# Altium project MB1297 revC.PrjPcb (part 1 of 2)
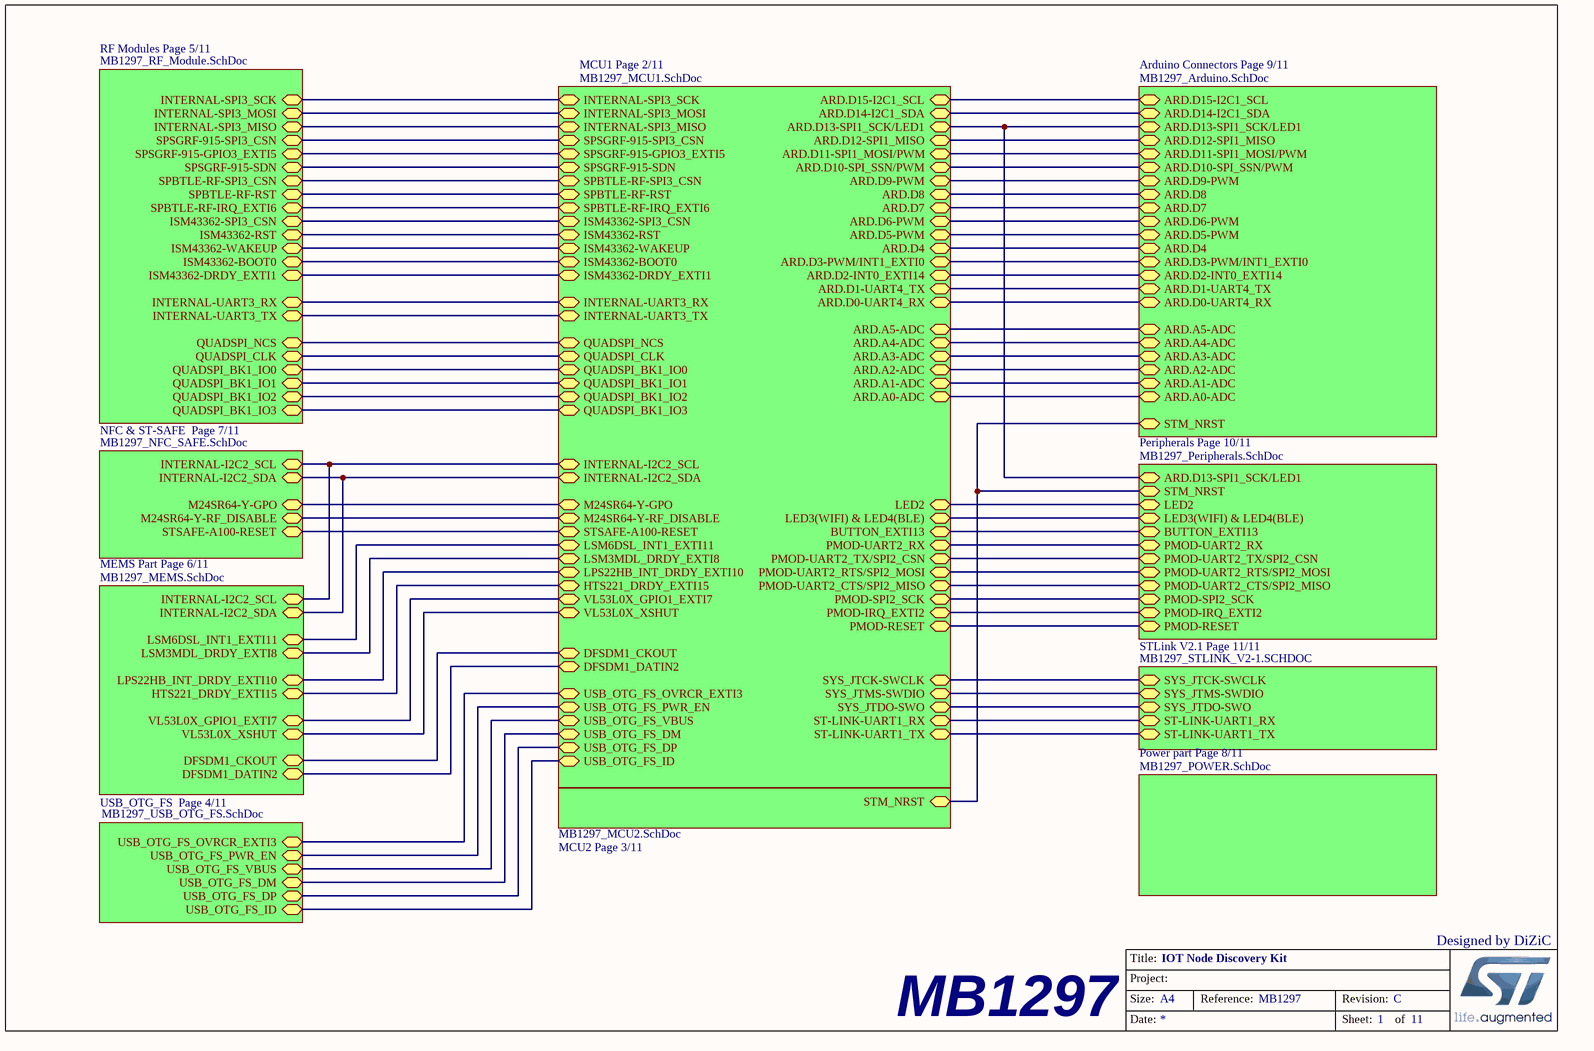
[diagram p0: MB1297_Intro.SchDoc]
11 sheets, 231 parts. Net scope: hierarchical (ports join the sheet entries above them; power ports are global).
Board file: MB1297 revC1.PcbDoc
Sheets:
  MB1297_Intro.SchDoc
    MCU1 Page 2/11 = MB1297_MCU1.SchDoc
    MCU2 Page 3/11 = MB1297_MCU2.SchDoc
    RF Modules Page 5/11 = MB1297_RF_Module.SchDoc
    Peripherals Page 10/11 = MB1297_Peripherals.SchDoc
    NFC & ST-SAFE  Page 7/11 = MB1297_NFC_SAFE.SchDoc
    STLink V2.1 Page 11/11 = MB1297_STLINK_V2-1.SCHDOC
    Arduino Connectors Page 9/11 = MB1297_Arduino.SchDoc
    MEMS Part Page 6/11 = MB1297_MEMS.SchDoc
    USB_OTG_FS  Page 4/11 = MB1297_USB_OTG_FS.SchDoc
    Power part Page 8/11 = MB1297_POWER.SchDoc

## Sheet MB1297_Intro.SchDoc: IOT Node Discovery Kit
size A4; DocumentNumber: MB1297; Revision: C; SheetNumber: 1; SheetTotal: 11

### Sub-sheets
Arduino Connectors Page 9/11 = MB1297_Arduino.SchDoc: ARD.D3-PWM/INT1_EXTI0, ARD.D2-INT0_EXTI14, ARD.D1-UART4_TX, ARD.D0-UART4_RX, ARD.A5-ADC, ARD.A4-ADC, ARD.A3-ADC, ARD.A2-ADC, ARD.A1-ADC, ARD.A0-ADC, ARD.D4, ARD.D5-PWM, ARD.D6-PWM, ARD.D7, ARD.D8, ARD.D9-PWM, ARD.D10-SPI_SSN/PWM, ARD.D11-SPI1_MOSI/PWM, ARD.D12-SPI1_MISO, ARD.D13-SPI1_SCK/LED1, ARD.D14-I2C1_SDA, ARD.D15-I2C1_SCL, STM_NRST
MCU1 Page 2/11 = MB1297_MCU1.SchDoc: INTERNAL-SPI3_SCK, INTERNAL-SPI3_MOSI, INTERNAL-SPI3_MISO, ISM43362-SPI3_CSN, SPSGRF-915-SDN, SPSGRF-915-SPI3_CSN, SPBTLE-RF-SPI3_CSN, SYS_JTCK-SWCLK, SYS_JTMS-SWDIO, ARD.D3-PWM/INT1_EXTI0, ARD.D2-INT0_EXTI14, ARD.D1-UART4_TX, ARD.D0-UART4_RX, ARD.D4, ARD.D5-PWM, ARD.D6-PWM, ARD.D7, ARD.D8, ARD.D9-PWM, ARD.D10-SPI_SSN/PWM, ARD.D11-SPI1_MOSI/PWM, ARD.D12-SPI1_MISO, ARD.D13-SPI1_SCK/LED1, ARD.D14-I2C1_SDA, ARD.D15-I2C1_SCL, ARD.A5-ADC, ARD.A4-ADC, ARD.A3-ADC, ARD.A2-ADC, ARD.A1-ADC, ARD.A0-ADC, USB_OTG_FS_OVRCR_EXTI3, USB_OTG_FS_PWR_EN, USB_OTG_FS_VBUS, USB_OTG_FS_DM, USB_OTG_FS_DP, USB_OTG_FS_ID, INTERNAL-I2C2_SCL, INTERNAL-I2C2_SDA, M24SR64-Y-GPO, M24SR64-Y-RF_DISABLE, STSAFE-A100-RESET, LED2, LED3(WIFI) & LED4(BLE), BUTTON_EXTI13, PMOD-UART2_RTS/SPI2_MOSI, PMOD-UART2_CTS/SPI2_MISO, PMOD-SPI2_SCK, PMOD-IRQ_EXTI2, PMOD-RESET, PMOD-UART2_RX, PMOD-UART2_TX/SPI2_CSN, LSM6DSL_INT1_EXTI11, LSM3MDL_DRDY_EXTI8, LPS22HB_INT_DRDY_EXTI10, HTS221_DRDY_EXTI15, VL53L0X_GPIO1_EXTI7, VL53L0X_XSHUT, DFSDM1_CKOUT, DFSDM1_DATIN2, SPBTLE-RF-RST, SYS_JTDO-SWO, QUADSPI_NCS, QUADSPI_CLK, QUADSPI_BK1_IO0, QUADSPI_BK1_IO1, QUADSPI_BK1_IO2, QUADSPI_BK1_IO3, SPSGRF-915-GPIO3_EXTI5, SPBTLE-RF-IRQ_EXTI6, ISM43362-DRDY_EXTI1, ISM43362-RST, ISM43362-WAKEUP, ISM43362-BOOT0, INTERNAL-UART3_RX, INTERNAL-UART3_TX, ST-LINK-UART1_RX, ST-LINK-UART1_TX
MCU2 Page 3/11 = MB1297_MCU2.SchDoc: STM_NRST
MEMS Part Page 6/11 = MB1297_MEMS.SchDoc: INTERNAL-I2C2_SCL, INTERNAL-I2C2_SDA, LSM6DSL_INT1_EXTI11, LSM3MDL_DRDY_EXTI8, LPS22HB_INT_DRDY_EXTI10, HTS221_DRDY_EXTI15, VL53L0X_GPIO1_EXTI7, VL53L0X_XSHUT, DFSDM1_CKOUT, DFSDM1_DATIN2
NFC & ST-SAFE  Page 7/11 = MB1297_NFC_SAFE.SchDoc: INTERNAL-I2C2_SCL, INTERNAL-I2C2_SDA, M24SR64-Y-GPO, M24SR64-Y-RF_DISABLE, STSAFE-A100-RESET
Peripherals Page 10/11 = MB1297_Peripherals.SchDoc: STM_NRST, ARD.D13-SPI1_SCK/LED1, LED2, LED3(WIFI) & LED4(BLE), BUTTON_EXTI13, PMOD-UART2_RTS/SPI2_MOSI, PMOD-UART2_CTS/SPI2_MISO, PMOD-SPI2_SCK, PMOD-IRQ_EXTI2, PMOD-RESET, PMOD-UART2_RX, PMOD-UART2_TX/SPI2_CSN
Power part Page 8/11 = MB1297_POWER.SchDoc: no entries
RF Modules Page 5/11 = MB1297_RF_Module.SchDoc: INTERNAL-SPI3_SCK, INTERNAL-SPI3_MOSI, INTERNAL-SPI3_MISO, SPSGRF-915-SPI3_CSN, SPSGRF-915-GPIO3_EXTI5, SPSGRF-915-SDN, SPBTLE-RF-SPI3_CSN, SPBTLE-RF-RST, SPBTLE-RF-IRQ_EXTI6, QUADSPI_NCS, QUADSPI_CLK, QUADSPI_BK1_IO0, QUADSPI_BK1_IO1, QUADSPI_BK1_IO2, QUADSPI_BK1_IO3, INTERNAL-UART3_RX, INTERNAL-UART3_TX, ISM43362-SPI3_CSN, ISM43362-RST, ISM43362-WAKEUP, ISM43362-BOOT0, ISM43362-DRDY_EXTI1
STLink V2.1 Page 11/11 = MB1297_STLINK_V2-1.SCHDOC: SYS_JTCK-SWCLK, SYS_JTMS-SWDIO, SYS_JTDO-SWO, ST-LINK-UART1_RX, ST-LINK-UART1_TX
USB_OTG_FS  Page 4/11 = MB1297_USB_OTG_FS.SchDoc: USB_OTG_FS_OVRCR_EXTI3, USB_OTG_FS_PWR_EN, USB_OTG_FS_VBUS, USB_OTG_FS_DM, USB_OTG_FS_DP, USB_OTG_FS_ID

### Nets
USB_N: sheet MCU1 Page 2/11/USB_OTG_FS_DM, sheet USB_OTG_FS  Page 4/11/USB_OTG_FS_DM
USB_P: sheet MCU1 Page 2/11/USB_OTG_FS_DP, sheet USB_OTG_FS  Page 4/11/USB_OTG_FS_DP
NetC3_2: sheet MCU2 Page 3/11/STM_NRST, sheet Peripherals Page 10/11/STM_NRST, sheet Arduino Connectors Page 9/11/STM_NRST
NetC66_1: sheet MCU1 Page 2/11/USB_OTG_FS_VBUS, sheet USB_OTG_FS  Page 4/11/USB_OTG_FS_VBUS
NetCN1_1: sheet MCU1 Page 2/11/ARD.D8, sheet Arduino Connectors Page 9/11/ARD.D8
NetCN1_2: sheet MCU1 Page 2/11/ARD.D9-PWM, sheet Arduino Connectors Page 9/11/ARD.D9-PWM
NetCN1_3: sheet MCU1 Page 2/11/ARD.D10-SPI_SSN/PWM, sheet Arduino Connectors Page 9/11/ARD.D10-SPI_SSN/PWM
NetCN1_4: sheet MCU1 Page 2/11/ARD.D11-SPI1_MOSI/PWM, sheet Arduino Connectors Page 9/11/ARD.D11-SPI1_MOSI/PWM
NetCN1_5: sheet MCU1 Page 2/11/ARD.D12-SPI1_MISO, sheet Arduino Connectors Page 9/11/ARD.D12-SPI1_MISO
NetCN1_6: sheet MCU1 Page 2/11/ARD.D13-SPI1_SCK/LED1, sheet Peripherals Page 10/11/ARD.D13-SPI1_SCK/LED1, sheet Arduino Connectors Page 9/11/ARD.D13-SPI1_SCK/LED1
NetCN1_9: sheet MCU1 Page 2/11/ARD.D14-I2C1_SDA, sheet Arduino Connectors Page 9/11/ARD.D14-I2C1_SDA
NetCN1_10: sheet MCU1 Page 2/11/ARD.D15-I2C1_SCL, sheet Arduino Connectors Page 9/11/ARD.D15-I2C1_SCL
NetCN3_1: sheet MCU1 Page 2/11/ARD.D0-UART4_RX, sheet Arduino Connectors Page 9/11/ARD.D0-UART4_RX
NetCN3_2: sheet MCU1 Page 2/11/ARD.D1-UART4_TX, sheet Arduino Connectors Page 9/11/ARD.D1-UART4_TX
NetCN3_3: sheet MCU1 Page 2/11/ARD.D2-INT0_EXTI14, sheet Arduino Connectors Page 9/11/ARD.D2-INT0_EXTI14
NetCN3_4: sheet MCU1 Page 2/11/ARD.D3-PWM/INT1_EXTI0, sheet Arduino Connectors Page 9/11/ARD.D3-PWM/INT1_EXTI0
NetCN3_5: sheet MCU1 Page 2/11/ARD.D4, sheet Arduino Connectors Page 9/11/ARD.D4
NetCN3_6: sheet MCU1 Page 2/11/ARD.D5-PWM, sheet Arduino Connectors Page 9/11/ARD.D5-PWM
NetCN3_7: sheet MCU1 Page 2/11/ARD.D6-PWM, sheet Arduino Connectors Page 9/11/ARD.D6-PWM
NetCN3_8: sheet MCU1 Page 2/11/ARD.D7, sheet Arduino Connectors Page 9/11/ARD.D7
NetCN4_1: sheet MCU1 Page 2/11/ARD.A0-ADC, sheet Arduino Connectors Page 9/11/ARD.A0-ADC
NetCN4_2: sheet MCU1 Page 2/11/ARD.A1-ADC, sheet Arduino Connectors Page 9/11/ARD.A1-ADC
NetCN4_3: sheet MCU1 Page 2/11/ARD.A2-ADC, sheet Arduino Connectors Page 9/11/ARD.A2-ADC
NetCN4_4: sheet MCU1 Page 2/11/ARD.A3-ADC, sheet Arduino Connectors Page 9/11/ARD.A3-ADC
NetCN4_5: sheet MCU1 Page 2/11/ARD.A4-ADC, sheet Arduino Connectors Page 9/11/ARD.A4-ADC
NetCN4_6: sheet MCU1 Page 2/11/ARD.A5-ADC, sheet Arduino Connectors Page 9/11/ARD.A5-ADC
NetCN9_4: sheet MCU1 Page 2/11/USB_OTG_FS_ID, sheet USB_OTG_FS  Page 4/11/USB_OTG_FS_ID
NetCN10_7: sheet MCU1 Page 2/11/PMOD-IRQ_EXTI2, sheet Peripherals Page 10/11/PMOD-IRQ_EXTI2
NetCN10_8: sheet MCU1 Page 2/11/PMOD-RESET, sheet Peripherals Page 10/11/PMOD-RESET
NetM1_4: sheet MCU1 Page 2/11/SPBTLE-RF-IRQ_EXTI6, sheet RF Modules Page 5/11/SPBTLE-RF-IRQ_EXTI6
NetM1_7: sheet MCU1 Page 2/11/INTERNAL-SPI3_SCK, sheet RF Modules Page 5/11/INTERNAL-SPI3_SCK
NetM1_8: sheet MCU1 Page 2/11/INTERNAL-SPI3_MISO, sheet RF Modules Page 5/11/INTERNAL-SPI3_MISO
NetM1_9: sheet MCU1 Page 2/11/INTERNAL-SPI3_MOSI, sheet RF Modules Page 5/11/INTERNAL-SPI3_MOSI
NetM1_10: sheet MCU1 Page 2/11/SPBTLE-RF-SPI3_CSN, sheet RF Modules Page 5/11/SPBTLE-RF-SPI3_CSN
NetM1_11: sheet MCU1 Page 2/11/SPBTLE-RF-RST, sheet RF Modules Page 5/11/SPBTLE-RF-RST
NetM2_12: sheet MCU1 Page 2/11/ISM43362-SPI3_CSN, sheet RF Modules Page 5/11/ISM43362-SPI3_CSN
NetM2_13: sheet MCU1 Page 2/11/ISM43362-DRDY_EXTI1, sheet RF Modules Page 5/11/ISM43362-DRDY_EXTI1
NetM2_16: sheet MCU1 Page 2/11/ISM43362-WAKEUP, sheet RF Modules Page 5/11/ISM43362-WAKEUP
NetM2_21: sheet MCU1 Page 2/11/INTERNAL-UART3_TX, sheet RF Modules Page 5/11/INTERNAL-UART3_TX
NetM2_22: sheet MCU1 Page 2/11/INTERNAL-UART3_RX, sheet RF Modules Page 5/11/INTERNAL-UART3_RX
NetM2_33: sheet MCU1 Page 2/11/ISM43362-BOOT0, sheet RF Modules Page 5/11/ISM43362-BOOT0
NetM2_34: sheet MCU1 Page 2/11/ISM43362-RST, sheet RF Modules Page 5/11/ISM43362-RST
NetM3_1: sheet MCU1 Page 2/11/SPSGRF-915-GPIO3_EXTI5, sheet RF Modules Page 5/11/SPSGRF-915-GPIO3_EXTI5
NetM3_10: sheet MCU1 Page 2/11/SPSGRF-915-SPI3_CSN, sheet RF Modules Page 5/11/SPSGRF-915-SPI3_CSN
NetM3_11: sheet MCU1 Page 2/11/SPSGRF-915-SDN, sheet RF Modules Page 5/11/SPSGRF-915-SDN
NetR1_2: sheet MCU1 Page 2/11/M24SR64-Y-RF_DISABLE, sheet NFC & ST-SAFE  Page 7/11/M24SR64-Y-RF_DISABLE
NetR4_2: sheet MCU1 Page 2/11/M24SR64-Y-GPO, sheet NFC & ST-SAFE  Page 7/11/M24SR64-Y-GPO
NetR6_2: sheet MCU1 Page 2/11/DFSDM1_CKOUT, sheet MEMS Part Page 6/11/DFSDM1_CKOUT
NetR10_2: sheet MCU1 Page 2/11/INTERNAL-I2C2_SCL, sheet NFC & ST-SAFE  Page 7/11/INTERNAL-I2C2_SCL, sheet MEMS Part Page 6/11/INTERNAL-I2C2_SCL
NetR11_2: sheet MCU1 Page 2/11/INTERNAL-I2C2_SDA, sheet NFC & ST-SAFE  Page 7/11/INTERNAL-I2C2_SDA, sheet MEMS Part Page 6/11/INTERNAL-I2C2_SDA
NetR13_2: sheet MCU1 Page 2/11/DFSDM1_DATIN2, sheet MEMS Part Page 6/11/DFSDM1_DATIN2
NetR14_2: sheet MCU1 Page 2/11/VL53L0X_GPIO1_EXTI7, sheet MEMS Part Page 6/11/VL53L0X_GPIO1_EXTI7
NetR15_2: sheet MCU1 Page 2/11/VL53L0X_XSHUT, sheet MEMS Part Page 6/11/VL53L0X_XSHUT
NetR20_1: sheet MCU1 Page 2/11/LED2, sheet Peripherals Page 10/11/LED2
NetR21_1: sheet MCU1 Page 2/11/LED3(WIFI) & LED4(BLE), sheet Peripherals Page 10/11/LED3(WIFI) & LED4(BLE)
NetR32_2: sheet MCU1 Page 2/11/SYS_JTCK-SWCLK, sheet STLink V2.1 Page 11/11/SYS_JTCK-SWCLK
NetR33_2: sheet MCU1 Page 2/11/SYS_JTMS-SWDIO, sheet STLink V2.1 Page 11/11/SYS_JTMS-SWDIO
NetR35_2: sheet MCU1 Page 2/11/SYS_JTDO-SWO, sheet STLink V2.1 Page 11/11/SYS_JTDO-SWO
NetR42_2: sheet MCU1 Page 2/11/ST-LINK-UART1_RX, sheet STLink V2.1 Page 11/11/ST-LINK-UART1_RX
NetR43_2: sheet MCU1 Page 2/11/ST-LINK-UART1_TX, sheet STLink V2.1 Page 11/11/ST-LINK-UART1_TX
NetR56_1: sheet MCU1 Page 2/11/USB_OTG_FS_OVRCR_EXTI3, sheet USB_OTG_FS  Page 4/11/USB_OTG_FS_OVRCR_EXTI3
NetR62_2: sheet MCU1 Page 2/11/USB_OTG_FS_PWR_EN, sheet USB_OTG_FS  Page 4/11/USB_OTG_FS_PWR_EN
NetSB3_1: sheet MCU1 Page 2/11/BUTTON_EXTI13, sheet Peripherals Page 10/11/BUTTON_EXTI13
NetSB12_2: sheet MCU1 Page 2/11/PMOD-UART2_TX/SPI2_CSN, sheet Peripherals Page 10/11/PMOD-UART2_TX/SPI2_CSN
NetSB15_2: sheet MCU1 Page 2/11/PMOD-UART2_RTS/SPI2_MOSI, sheet Peripherals Page 10/11/PMOD-UART2_RTS/SPI2_MOSI
NetSB18_2: sheet MCU1 Page 2/11/PMOD-UART2_CTS/SPI2_MISO, sheet Peripherals Page 10/11/PMOD-UART2_CTS/SPI2_MISO
NetSB20_1: sheet MCU1 Page 2/11/PMOD-UART2_RX, sheet Peripherals Page 10/11/PMOD-UART2_RX
NetSB21_1: sheet MCU1 Page 2/11/PMOD-SPI2_SCK, sheet Peripherals Page 10/11/PMOD-SPI2_SCK
NetU1_41: sheet MCU1 Page 2/11/QUADSPI_CLK, sheet RF Modules Page 5/11/QUADSPI_CLK
NetU1_42: sheet MCU1 Page 2/11/QUADSPI_NCS, sheet RF Modules Page 5/11/QUADSPI_NCS
NetU1_43: sheet MCU1 Page 2/11/QUADSPI_BK1_IO0, sheet RF Modules Page 5/11/QUADSPI_BK1_IO0
NetU1_44: sheet MCU1 Page 2/11/QUADSPI_BK1_IO1, sheet RF Modules Page 5/11/QUADSPI_BK1_IO1
NetU1_45: sheet MCU1 Page 2/11/QUADSPI_BK1_IO2, sheet RF Modules Page 5/11/QUADSPI_BK1_IO2
NetU1_46: sheet MCU1 Page 2/11/QUADSPI_BK1_IO3, sheet RF Modules Page 5/11/QUADSPI_BK1_IO3
NetU1_57: sheet MCU1 Page 2/11/LPS22HB_INT_DRDY_EXTI10, sheet MEMS Part Page 6/11/LPS22HB_INT_DRDY_EXTI10
NetU1_58: sheet MCU1 Page 2/11/LSM6DSL_INT1_EXTI11, sheet MEMS Part Page 6/11/LSM6DSL_INT1_EXTI11
NetU1_62: sheet MCU1 Page 2/11/HTS221_DRDY_EXTI15, sheet MEMS Part Page 6/11/HTS221_DRDY_EXTI15
NetU1_65: sheet MCU1 Page 2/11/LSM3MDL_DRDY_EXTI8, sheet MEMS Part Page 6/11/LSM3MDL_DRDY_EXTI8
NetU1_88: sheet MCU1 Page 2/11/STSAFE-A100-RESET, sheet NFC & ST-SAFE  Page 7/11/STSAFE-A100-RESET

### Notes on the sheet
- Designed by DiZiC
- MB1297
- Title:
- Project:
- Size:
- Date:
- A4
- Reference:
- Sheet:
- Revision:
- of

## Sheet MB1297_MCU1.SchDoc: STM32L475 - 1/2
size A4; DocumentNumber: MB1297; Revision: C; SheetNumber: 2; SheetTotal: 11
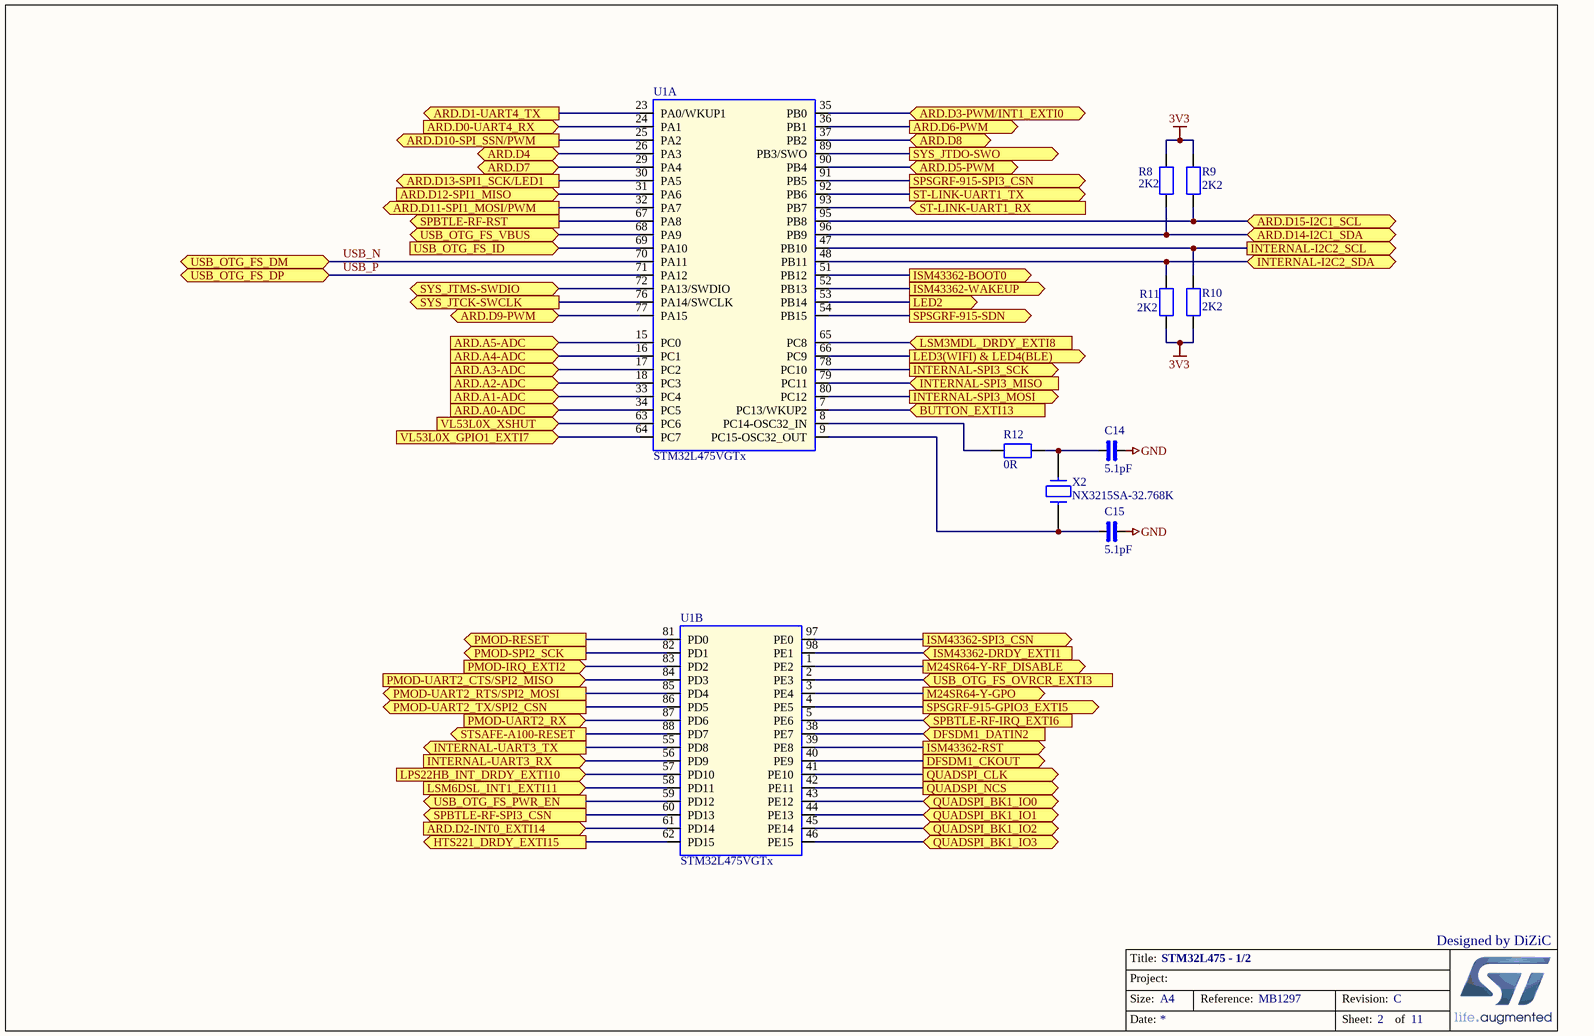
[diagram p1: MB1297_MCU1.SchDoc]

### Parts
C14  5.1pF  [0402_CAP_NPOL]
C15  5.1pF  [0402_CAP_NPOL]
R8  2K2  [0402_RES]
R9  2K2  [0402_RES]
R10  2K2  [0402_RES]
R11  2K2  [0402_RES]
R12  0R  [0402_RES]
U1  STM32L475VGTx  [LQFP100 14x14x1.6]  (parts A,B of 3)
X2  NX3215SA-32.768K  [CRY_NX3215SA_2P]

### Ports
ARD.A0-ADC, ARD.A1-ADC, ARD.A2-ADC, ARD.A3-ADC, ARD.A4-ADC, ARD.A5-ADC, ARD.D0-UART4_RX, ARD.D1-UART4_TX, ARD.D2-INT0_EXTI14, ARD.D3-PWM/INT1_EXTI0, ARD.D4, ARD.D5-PWM, ARD.D6-PWM, ARD.D7, ARD.D8, ARD.D9-PWM, ARD.D10-SPI_SSN/PWM, ARD.D11-SPI1_MOSI/PWM, ARD.D12-SPI1_MISO, ARD.D13-SPI1_SCK/LED1, ARD.D14-I2C1_SDA, ARD.D15-I2C1_SCL, BUTTON_EXTI13, DFSDM1_CKOUT, DFSDM1_DATIN2, HTS221_DRDY_EXTI15, INTERNAL-I2C2_SCL, INTERNAL-I2C2_SDA, INTERNAL-SPI3_MISO, INTERNAL-SPI3_MOSI, INTERNAL-SPI3_SCK, INTERNAL-UART3_RX, INTERNAL-UART3_TX, ISM43362-BOOT0, ISM43362-DRDY_EXTI1, ISM43362-RST, ISM43362-SPI3_CSN, ISM43362-WAKEUP, LED2, LED3(WIFI) & LED4(BLE), LPS22HB_INT_DRDY_EXTI10, LSM3MDL_DRDY_EXTI8, LSM6DSL_INT1_EXTI11, M24SR64-Y-GPO, M24SR64-Y-RF_DISABLE, PMOD-IRQ_EXTI2, PMOD-RESET, PMOD-SPI2_SCK, PMOD-UART2_CTS/SPI2_MISO, PMOD-UART2_RTS/SPI2_MOSI, PMOD-UART2_RX, PMOD-UART2_TX/SPI2_CSN, QUADSPI_BK1_IO0, QUADSPI_BK1_IO1, QUADSPI_BK1_IO2, QUADSPI_BK1_IO3, QUADSPI_CLK, QUADSPI_NCS, SPBTLE-RF-IRQ_EXTI6, SPBTLE-RF-RST, SPBTLE-RF-SPI3_CSN, SPSGRF-915-GPIO3_EXTI5, SPSGRF-915-SDN, SPSGRF-915-SPI3_CSN, ST-LINK-UART1_RX, ST-LINK-UART1_TX, STSAFE-A100-RESET, SYS_JTCK-SWCLK, SYS_JTDO-SWO, SYS_JTMS-SWDIO, USB_OTG_FS_DM, USB_OTG_FS_DP, USB_OTG_FS_ID, USB_OTG_FS_OVRCR_EXTI3, USB_OTG_FS_PWR_EN, USB_OTG_FS_VBUS, VL53L0X_GPIO1_EXTI7, VL53L0X_XSHUT

### Nets
3V3: R8.1 R9.1 R10.1 R11.1
GND: C14.2 C15.2
USB_N: U1.70(PA11) ; port USB_OTG_FS_DM
USB_P: U1.71(PA12) ; port USB_OTG_FS_DP
NetC14_1: C14.1 R12.2 X2.1
NetC15_1: C15.1 U1.9(PC15-OSC32_OUT) X2.2
NetC66_1: U1.68(PA9) ; port USB_OTG_FS_VBUS
NetCN1_1: U1.37(PB2) ; port ARD.D8
NetCN1_2: U1.77(PA15) ; port ARD.D9-PWM
NetCN1_3: U1.25(PA2) ; port ARD.D10-SPI_SSN/PWM
NetCN1_4: U1.32(PA7) ; port ARD.D11-SPI1_MOSI/PWM
NetCN1_5: U1.31(PA6) ; port ARD.D12-SPI1_MISO
NetCN1_6: U1.30(PA5) ; port ARD.D13-SPI1_SCK/LED1
NetCN1_9: R8.2 U1.96(PB9) ; port ARD.D14-I2C1_SDA
NetCN1_10: R9.2 U1.95(PB8) ; port ARD.D15-I2C1_SCL
NetCN3_1: U1.24(PA1) ; port ARD.D0-UART4_RX
NetCN3_2: U1.23(PA0/WKUP1) ; port ARD.D1-UART4_TX
NetCN3_3: U1.61(PD14) ; port ARD.D2-INT0_EXTI14
NetCN3_4: U1.35(PB0) ; port ARD.D3-PWM/INT1_EXTI0
NetCN3_5: U1.26(PA3) ; port ARD.D4
NetCN3_6: U1.90(PB4) ; port ARD.D5-PWM
NetCN3_7: U1.36(PB1) ; port ARD.D6-PWM
NetCN3_8: U1.29(PA4) ; port ARD.D7
NetCN4_1: U1.34(PC5) ; port ARD.A0-ADC
NetCN4_2: U1.33(PC4) ; port ARD.A1-ADC
NetCN4_3: U1.18(PC3) ; port ARD.A2-ADC
NetCN4_4: U1.17(PC2) ; port ARD.A3-ADC
NetCN4_5: U1.16(PC1) ; port ARD.A4-ADC
NetCN4_6: U1.15(PC0) ; port ARD.A5-ADC
NetCN9_4: U1.69(PA10) ; port USB_OTG_FS_ID
NetCN10_7: U1.83(PD2) ; port PMOD-IRQ_EXTI2
NetCN10_8: U1.81(PD0) ; port PMOD-RESET
NetM1_4: U1.5(PE6) ; port SPBTLE-RF-IRQ_EXTI6
NetM1_7: U1.78(PC10) ; port INTERNAL-SPI3_SCK
NetM1_8: U1.79(PC11) ; port INTERNAL-SPI3_MISO
NetM1_9: U1.80(PC12) ; port INTERNAL-SPI3_MOSI
NetM1_10: U1.60(PD13) ; port SPBTLE-RF-SPI3_CSN
NetM1_11: U1.67(PA8) ; port SPBTLE-RF-RST
NetM2_12: U1.97(PE0) ; port ISM43362-SPI3_CSN
NetM2_13: U1.98(PE1) ; port ISM43362-DRDY_EXTI1
NetM2_16: U1.52(PB13) ; port ISM43362-WAKEUP
NetM2_21: U1.55(PD8) ; port INTERNAL-UART3_TX
NetM2_22: U1.56(PD9) ; port INTERNAL-UART3_RX
NetM2_33: U1.51(PB12) ; port ISM43362-BOOT0
NetM2_34: U1.39(PE8) ; port ISM43362-RST
NetM3_1: U1.4(PE5) ; port SPSGRF-915-GPIO3_EXTI5
NetM3_10: U1.91(PB5) ; port SPSGRF-915-SPI3_CSN
NetM3_11: U1.54(PB15) ; port SPSGRF-915-SDN
NetR1_2: U1.1(PE2) ; port M24SR64-Y-RF_DISABLE
NetR4_2: U1.3(PE4) ; port M24SR64-Y-GPO
NetR6_2: U1.40(PE9) ; port DFSDM1_CKOUT
NetR10_2: R10.2 U1.47(PB10) ; port INTERNAL-I2C2_SCL
NetR11_2: R11.2 U1.48(PB11) ; port INTERNAL-I2C2_SDA
NetR12_1: R12.1 U1.8(PC14-OSC32_IN)
NetR13_2: U1.38(PE7) ; port DFSDM1_DATIN2
NetR14_2: U1.64(PC7) ; port VL53L0X_GPIO1_EXTI7
NetR15_2: U1.63(PC6) ; port VL53L0X_XSHUT
NetR20_1: U1.53(PB14) ; port LED2
NetR21_1: U1.66(PC9) ; port LED3(WIFI) & LED4(BLE)
NetR32_2: U1.76(PA14/SWCLK) ; port SYS_JTCK-SWCLK
NetR33_2: U1.72(PA13/SWDIO) ; port SYS_JTMS-SWDIO
NetR35_2: U1.89(PB3/SWO) ; port SYS_JTDO-SWO
NetR42_2: U1.93(PB7) ; port ST-LINK-UART1_RX
NetR43_2: U1.92(PB6) ; port ST-LINK-UART1_TX
NetR56_1: U1.2(PE3) ; port USB_OTG_FS_OVRCR_EXTI3
NetR62_2: U1.59(PD12) ; port USB_OTG_FS_PWR_EN
NetSB3_1: U1.7(PC13/WKUP2) ; port BUTTON_EXTI13
NetSB12_2: U1.86(PD5) ; port PMOD-UART2_TX/SPI2_CSN
NetSB15_2: U1.85(PD4) ; port PMOD-UART2_RTS/SPI2_MOSI
NetSB18_2: U1.84(PD3) ; port PMOD-UART2_CTS/SPI2_MISO
NetSB20_1: U1.87(PD6) ; port PMOD-UART2_RX
NetSB21_1: U1.82(PD1) ; port PMOD-SPI2_SCK
NetU1_41: U1.41(PE10) ; port QUADSPI_CLK
NetU1_42: U1.42(PE11) ; port QUADSPI_NCS
NetU1_43: U1.43(PE12) ; port QUADSPI_BK1_IO0
NetU1_44: U1.44(PE13) ; port QUADSPI_BK1_IO1
NetU1_45: U1.45(PE14) ; port QUADSPI_BK1_IO2
NetU1_46: U1.46(PE15) ; port QUADSPI_BK1_IO3
NetU1_57: U1.57(PD10) ; port LPS22HB_INT_DRDY_EXTI10
NetU1_58: U1.58(PD11) ; port LSM6DSL_INT1_EXTI11
NetU1_62: U1.62(PD15) ; port HTS221_DRDY_EXTI15
NetU1_65: U1.65(PC8) ; port LSM3MDL_DRDY_EXTI8
NetU1_88: U1.88(PD7) ; port STSAFE-A100-RESET

### Notes on the sheet
- Designed by DiZiC
- Title:
- Project:
- Size:
- Date:
- A4
- Reference:
- Sheet:
- Revision:
- of

### Library data of the parts
C14 C15 = CAP_NPOL: Capacitor_not polarized
R8-R12 = RES: Resistor
X2 = XTAL_32K_NX3215SA: Crystal 32.768kHz, 6pF, -+20PPM, R=50K, SMD; Manuf_1: NDK; Manuf_Part_1: NX3215SA 32.768KHz EXS00A-MU00525; ECCN_US/EU: EAR99/NEC; Ref St: 9157034; NDK Ref: X3101802; Fitted: YES; Ordered_By: STM; Distrib: *; Order_Code: NX3215SA 32.768KHz EXS00A-MU00525; Value: NX3215SA-32.768K

## Sheet MB1297_MCU2.SchDoc: STM32L475 - 2/2
size A4; DocumentNumber: MB1297; Revision: C; SheetNumber: 3; SheetTotal: 11
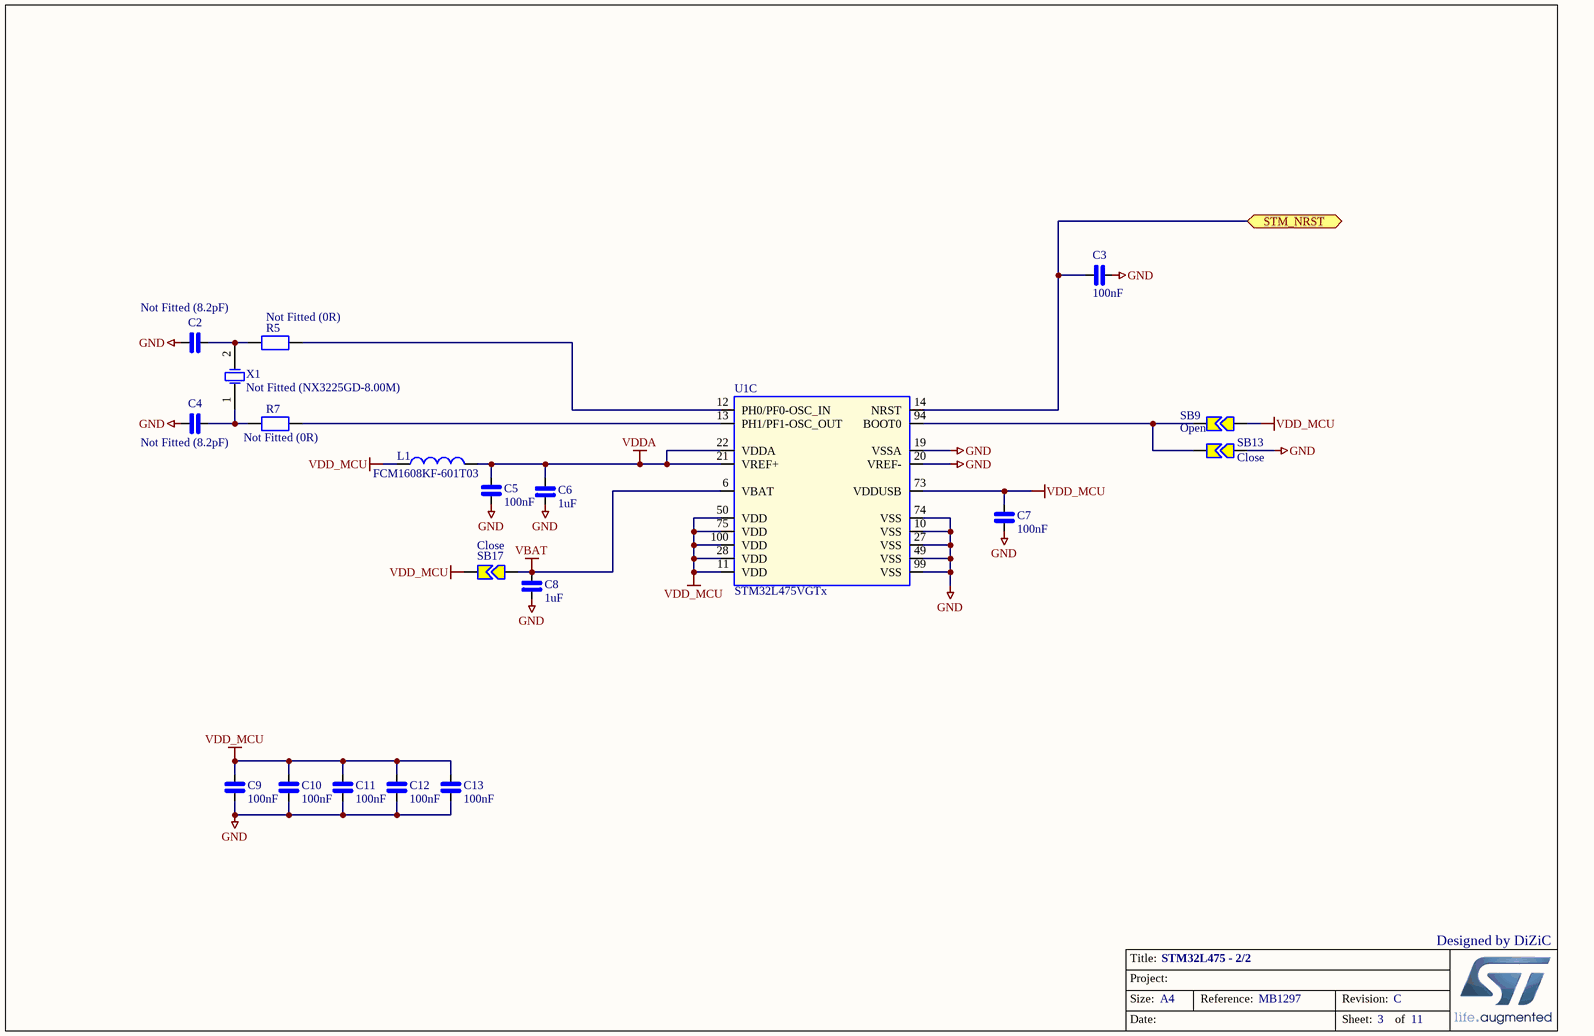
[diagram p2: MB1297_MCU2.SchDoc]

### Parts
C2  Not Fitted (8.2pF)  [0402_CAP_NPOL]
C3  100nF  [0402_CAP_NPOL]
C4  Not Fitted (8.2pF)  [0402_CAP_NPOL]
C5  100nF  [0402_CAP_NPOL]
C6  1uF  [0402_CAP_NPOL]
C7  100nF  [0402_CAP_NPOL]
C8  1uF  [0402_CAP_NPOL]
C9  100nF  [0402_CAP_NPOL]
C10  100nF  [0402_CAP_NPOL]
C11  100nF  [0402_CAP_NPOL]
C12  100nF  [0402_CAP_NPOL]
C13  100nF  [0402_CAP_NPOL]
L1  FCM1608KF-601T03  [0603L]
R5  Not Fitted (0R)  [0402_RES]
R7  Not Fitted (0R)  [0402_RES]
SB9  Open  [SB]
SB13  Close  [SB]
SB17  Close  [SB]
U1  STM32L475VGTx  [LQFP100 14x14x1.6]  (part C of 3)
X1  Not Fitted (NX3225GD-8.00M)  [CRY_NX3225GD_2P]

### Ports
STM_NRST

### Nets
GND: C2.2 C3.1 C4.2 C5.2 C6.1 C7.2 C8.1 C9.2 C10.2 C11.2 C12.2 C13.2 SB13.1 U1.10(VSS) U1.19(VSSA) U1.20(VREF-) U1.27(VSS) U1.49(VSS) U1.74(VSS) U1.99(VSS)
VBAT: C8.2 SB17.2 U1.6(VBAT)
VDD_MCU: C7.1 C9.1 C10.1 C11.1 C12.1 C13.1 L1.1 SB9.1 SB17.1 U1.11(VDD) U1.28(VDD) U1.50(VDD) U1.73(VDDUSB) U1.75(VDD) U1.100(VDD)
VDDA: C5.1 C6.2 L1.2 U1.21(VREF+) U1.22(VDDA)
NetC2_1: C2.1 R5.2 X1.2(OSC2)
NetC3_2: C3.2 U1.14(NRST) ; port STM_NRST
NetC4_1: C4.1 R7.2 X1.1(OSC1)
NetR5_1: R5.1 U1.12(PH0/PF0-OSC_IN)
NetR7_1: R7.1 U1.13(PH1/PF1-OSC_OUT)
NetSB9_2: SB9.2 SB13.2 U1.94(BOOT0)

### Notes on the sheet
- Designed by DiZiC
- Title:
- Project:
- Size:
- Date:
- A4
- Reference:
- Sheet:
- Revision:
- of

### Library data of the parts
C2-C13 = CAP_NPOL: Capacitor_not polarized
L1 = Inductor: Value: 100uH; Published: 8-Jun-2000; Revision: July-2002: Re-released for DXP Platform.; Publisher: Altium Limited
R5 R7 = RES: Resistor; FITTED: NO
SB9 SB13 SB17 = Strap2: Solder Jumper; Solder: YES; Published: 24-Mar-1999; Revision: July-2002: Re-released for DXP Platform.; Publisher: Altium Limited
X1 = XTAL_8M_NX3225GD: Crystal 8Mhz, 8pF, -+50PPM, SMD; Manuf_1: NDK; Manuf_Part_1: NX3225GD 8MHz EXS00A-CG04874; ECCN_US/EU: EAR99/NEC; NDK Ref: X3127326; Ref St: 9157029; Fitted: NO; Ordered_By: STM; Order_Code: NX3225GD 8MHz EXS00A-CG04874; Distrib: *; Value: Not Fitted (NX3225GD-8.00M)

## Sheet MB1297_RF_Module.SchDoc: RF Modules
size A4; DocumentNumber: MB1297; Revision: C; SheetNumber: 5; SheetTotal: 11
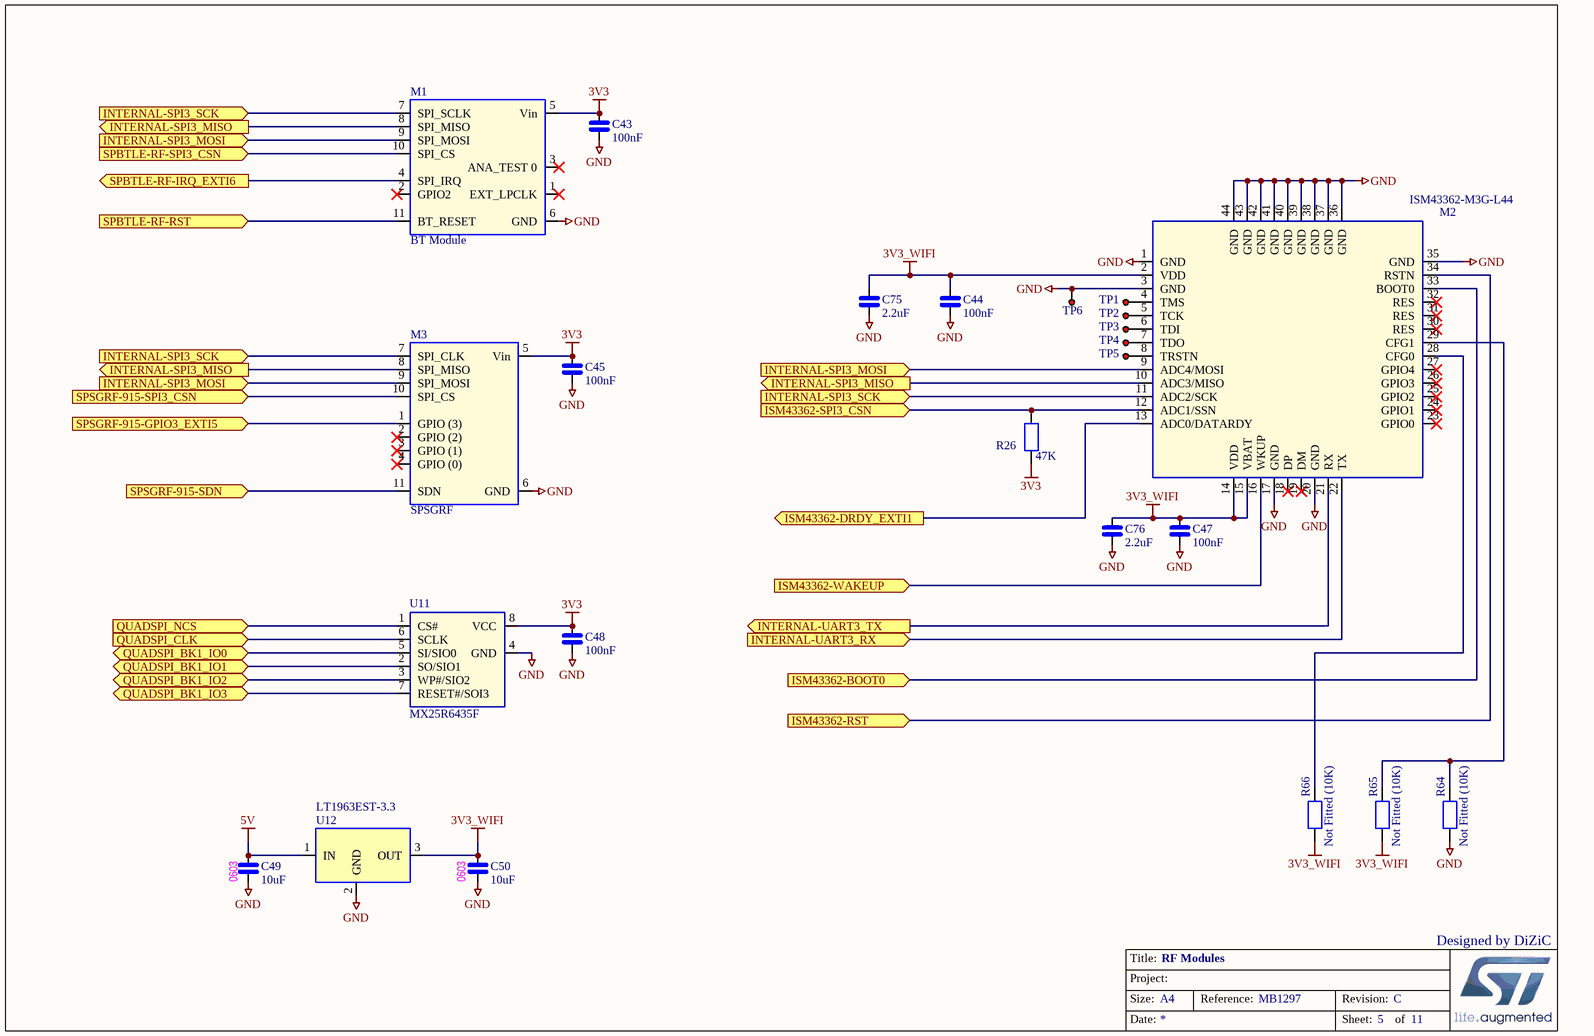
[diagram p3: MB1297_RF_Module.SchDoc]

### Parts
C43  100nF  [0402_CAP_NPOL]
C44  100nF  [0402_CAP_NPOL]
C45  100nF  [0402_CAP_NPOL]
C47  100nF  [0402_CAP_NPOL]
C48  100nF  [0402_CAP_NPOL]
C49  10uF  [0603_CAP_NPOL]
C50  10uF  [0603_CAP_NPOL]
C75  2.2uF  [0603_CAP_NPOL]
C76  2.2uF  [0603_CAP_NPOL]
M1  BT Module  [SPBTLE-RF]
M2  ISM43362-M3G-L44  [ISM43362-M3G-L44]
M3  SPSGRF  [SPSGRF]
R26  47K  [0402_RES]
R64  Not Fitted (10K)  [0402_RES]
R65  Not Fitted (10K)  [0402_RES]
R66  Not Fitted (10K)  [0402_RES]
TP1  PT  [PTB]  (value not drawn)
TP2  PT  [PTB]  (value not drawn)
TP3  PT  [PTB]  (value not drawn)
TP4  PT  [PTB]  (value not drawn)
TP5  PT  [PTB]  (value not drawn)
TP6  PT  [PTB]  (value not drawn)
U11  MX25R6435F  [SOP8L]
U12  LT1963EST-3.3  [SOT223_SC73]

### Ports
INTERNAL-SPI3_MISO, INTERNAL-SPI3_MOSI, INTERNAL-SPI3_SCK, INTERNAL-UART3_RX, INTERNAL-UART3_TX, ISM43362-BOOT0, ISM43362-DRDY_EXTI1, ISM43362-RST, ISM43362-SPI3_CSN, ISM43362-WAKEUP, QUADSPI_BK1_IO0, QUADSPI_BK1_IO1, QUADSPI_BK1_IO2, QUADSPI_BK1_IO3, QUADSPI_CLK, QUADSPI_NCS, SPBTLE-RF-IRQ_EXTI6, SPBTLE-RF-RST, SPBTLE-RF-SPI3_CSN, SPSGRF-915-GPIO3_EXTI5, SPSGRF-915-SDN, SPSGRF-915-SPI3_CSN

### Nets
3V3: C43.1 C45.1 C48.1 M1.5(Vin) M3.5(Vin) R26.2 U11.8(VCC)
3V3_WIFI: C44.1 C47.1 C50.1 C75.1 C76.1 M2.2(VDD) M2.14(VDD) M2.15(VBAT) R65.2 R66.2 U12.3(OUT)
5V: C49.1 U12.1(IN)
GND: C43.2 C44.2 C45.2 C47.2 C48.2 C49.2 C50.2 C75.2 C76.2 M1.6(GND) M2.1(GND) M2.3(GND) M2.17(GND) M2.20(GND) M2.35(GND) M2.36(GND) M2.37(GND) M2.38(GND) M2.39(GND) M2.40(GND) M2.41(GND) M2.42(GND) M2.43(GND) M2.44(GND) M3.6(GND) R64.2 TP6.1 U11.4(GND) U12.2(GND)
NetM1_4: M1.4(SPI_IRQ) ; port SPBTLE-RF-IRQ_EXTI6
NetM1_7: M1.7(SPI_SCLK) M2.11(ADC2/SCK) M3.7(SPI_CLK) ; port INTERNAL-SPI3_SCK
NetM1_8: M1.8(SPI_MISO) M2.10(ADC3/MISO) M3.8(SPI_MISO) ; port INTERNAL-SPI3_MISO
NetM1_9: M1.9(SPI_MOSI) M2.9(ADC4/MOSI) M3.9(SPI_MOSI) ; port INTERNAL-SPI3_MOSI
NetM1_10: M1.10(SPI_CS) ; port SPBTLE-RF-SPI3_CSN
NetM1_11: M1.11(BT_RESET) ; port SPBTLE-RF-RST
NetM2_4: M2.4(TMS) TP1.1
NetM2_5: M2.5(TCK) TP2.1
NetM2_6: M2.6(TDI) TP3.1
NetM2_7: M2.7(TDO) TP4.1
NetM2_8: M2.8(TRSTN) TP5.1
NetM2_12: M2.12(ADC1/SSN) R26.1 ; port ISM43362-SPI3_CSN
NetM2_13: M2.13(ADC0/DATARDY) ; port ISM43362-DRDY_EXTI1
NetM2_16: M2.16(WKUP) ; port ISM43362-WAKEUP
NetM2_21: M2.21(RX) ; port INTERNAL-UART3_TX
NetM2_22: M2.22(TX) ; port INTERNAL-UART3_RX
NetM2_28: M2.28(CFG0) R66.1
NetM2_29: M2.29(CFG1) R64.1 R65.1
NetM2_33: M2.33(BOOT0) ; port ISM43362-BOOT0
NetM2_34: M2.34(RSTN) ; port ISM43362-RST
NetM3_1: M3.1(GPIO_(3)) ; port SPSGRF-915-GPIO3_EXTI5
NetM3_10: M3.10(SPI_CS) ; port SPSGRF-915-SPI3_CSN
NetM3_11: M3.11(SDN) ; port SPSGRF-915-SDN
NetU1_41: U11.6(SCLK) ; port QUADSPI_CLK
NetU1_42: U11.1(CS#) ; port QUADSPI_NCS
NetU1_43: U11.5(SI/SIO0) ; port QUADSPI_BK1_IO0
NetU1_44: U11.2(SO/SIO1) ; port QUADSPI_BK1_IO1
NetU1_45: U11.3(WP#/SIO2) ; port QUADSPI_BK1_IO2
NetU1_46: U11.7(RESET#/SOI3) ; port QUADSPI_BK1_IO3

Not connected (* = marked no-connect by the designer): M1 1(EXT_LPCLK)* 2(GPIO2)* 3(ANA_TEST_0)*; M2 18(DP)* 19(DM)* 23(GPIO0)* 24(GPIO1)* 25(GPIO2)* 26(GPIO3)* 27(GPIO4)* 30(RES)* 31(RES)* 32(RES)*; M3 2(GPIO_(2))* 3(GPIO_(1))* 4(GPIO_(0))*

### Notes on the sheet
- (near C49) 0603
- (near C50) 0603
- Designed by DiZiC
- Title:
- Project:
- Size:
- Date:
- A4
- Reference:
- Sheet:
- Revision:
- of

### Library data of the parts
C43-C45 C47-C50 C75 C76 = CAP_NPOL: Capacitor_not polarized
M1 = SPBTLE-RF
M2 = ISM43362-M3G-L44: ISM43362-M3G-L44 Wifi Module 802.11 bgn
M3 = SPSGRF: SPSGRF-915or SPSGRF-868
R26 = RES: Resistor
R64-R66 = RES: Resistor; FITTED: NO
TP1-TP6 = PT: Point de test
U11 = MX25R6435F: MX25R6435F Serial Flash Memory 64M
U12 = LT1963EST-3.3: LT1963EST-3.3 LDO Low Noise 1.5A fast Transient Response

## Sheet MB1297_Peripherals.SchDoc: Peripherals
size A4; DocumentNumber: MB1297; Revision: C; SheetNumber: 10; SheetTotal: 11
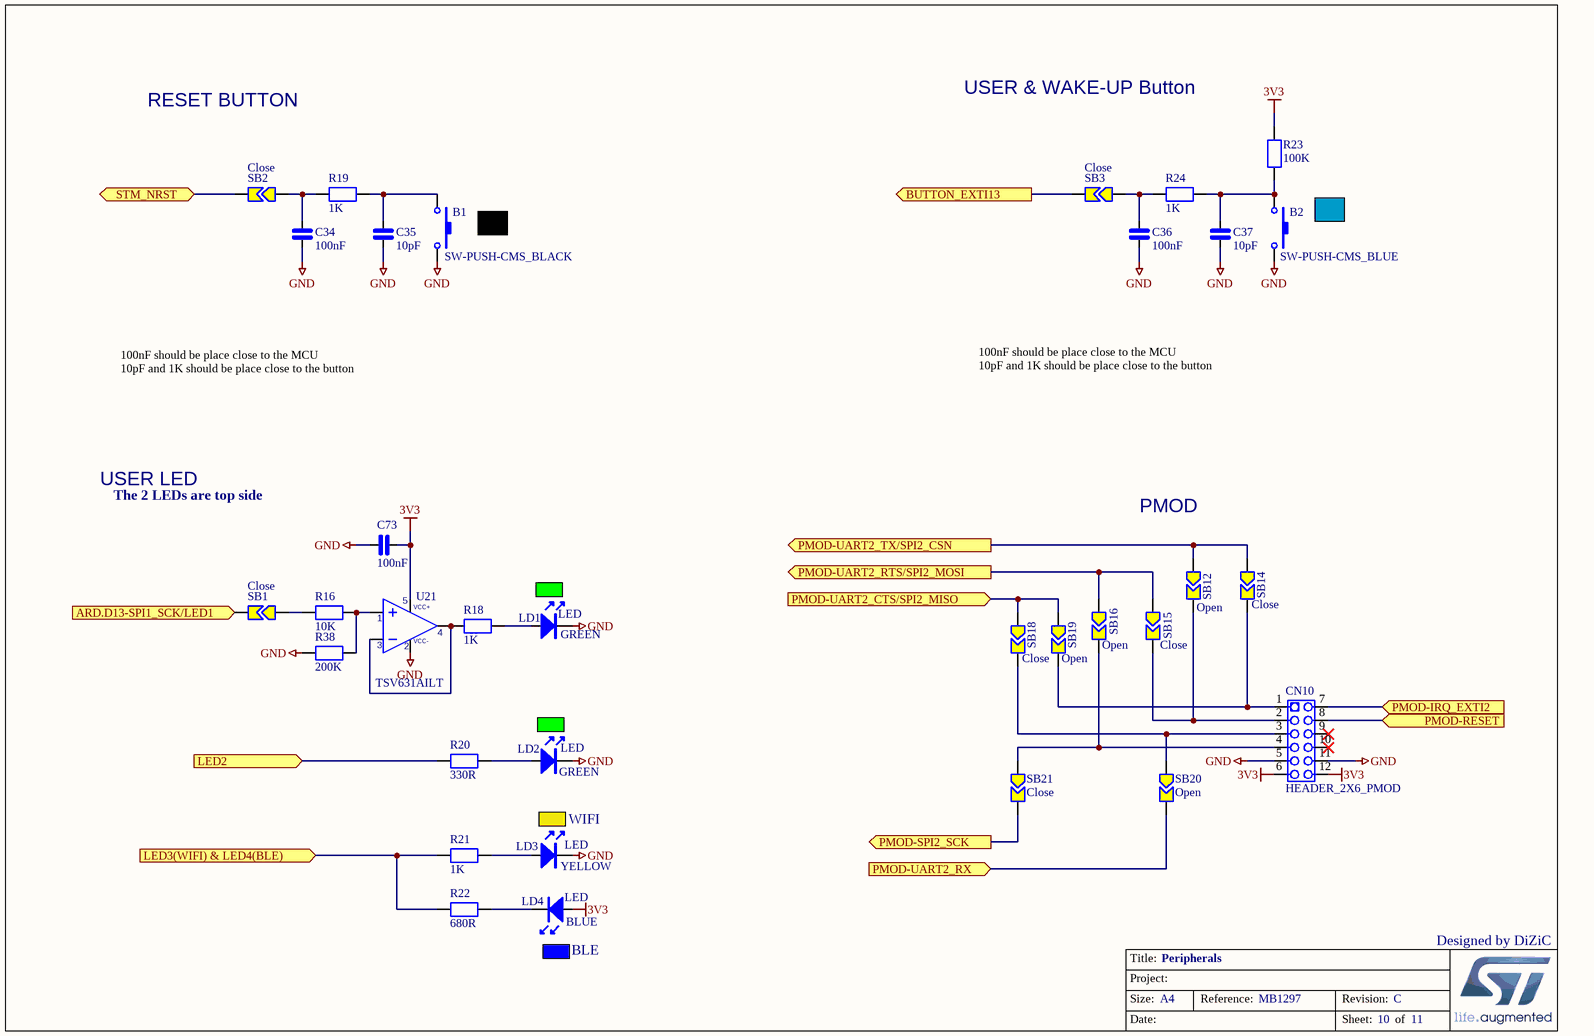
[diagram p4: MB1297_Peripherals.SchDoc]

### Parts
B1  SW-PUSH-CMS_BLACK  [SWI_WEALTHMETAL_TD-0341_4P - BACK]
B2  SW-PUSH-CMS_BLUE  [SWI_WEALTHMETAL_TD-0341_4P - BLUE]
C34  100nF  [0402_CAP_NPOL]
C35  10pF  [0402_CAP_NPOL]
C36  100nF  [0402_CAP_NPOL]
C37  10pF  [0402_CAP_NPOL]
C73  100nF  [0402_CAP_NPOL]
CN10  HEADER_2X6_PMOD  [Header F 2x6x2.54 TH H PMOD]
LD1  LED  Color: GREEN  [0603_LED_GREEN]
LD2  LED  Color: GREEN  [0603_LED_GREEN]
LD3  LED  Color: YELLOW  [0603_LED_Yellow]
LD4  LED  Color: BLUE  [0603_LED_Blue]
R16  10K  [0402_RES]
R18  1K  [0402_RES]
R19  1K  [0402_RES]
R20  330R  [0402_RES]
R21  1K  [0402_RES]
R22  680R  [0402_RES]
R23  100K  [0402_RES]
R24  1K  [0402_RES]
R38  200K  [0402_RES]
SB1  Close  [SB]
SB2  Close  [SB]
SB3  Close  [SB]
SB12  Open  [SB]
SB14  Close  [SB]
SB15  Close  [SB]
SB16  Open  [SB]
SB18  Close  [SB]
SB19  Open  [SB]
SB20  Open  [SB]
SB21  Close  [SB]
U21  TSV631AILT  [SOT23-5]

### Ports
ARD.D13-SPI1_SCK/LED1, BUTTON_EXTI13, LED2 (in), LED3(WIFI) & LED4(BLE), PMOD-IRQ_EXTI2, PMOD-RESET, PMOD-SPI2_SCK, PMOD-UART2_CTS/SPI2_MISO, PMOD-UART2_RTS/SPI2_MOSI, PMOD-UART2_RX, PMOD-UART2_TX/SPI2_CSN, STM_NRST

### Nets
3V3: C73.1 CN10.6 CN10.12 LD4.A R23.2 U21.5(V+)
GND: B1.2 B2.2 C34.2 C35.2 C36.2 C37.2 C73.2 CN10.5 CN10.11 LD1.K LD2.K LD3.K R38.1 U21.2(V-)
NetB1_1: B1.1 C35.1 R19.2
NetB2_1: B2.1 C37.1 R23.1 R24.2
NetC3_2: SB2.1 ; port STM_NRST
NetC34_1: C34.1 R19.1 SB2.2
NetC36_1: C36.1 R24.1 SB3.2
NetCN1_6: SB1.1 ; port ARD.D13-SPI1_SCK/LED1
NetCN10_1: CN10.1 SB14.1 SB19.1
NetCN10_2: CN10.2 SB12.1 SB15.1
NetCN10_3: CN10.3 SB18.1 SB20.2
NetCN10_4: CN10.4 SB16.1 SB21.2
NetCN10_7: CN10.7 ; port PMOD-IRQ_EXTI2
NetCN10_8: CN10.8 ; port PMOD-RESET
NetLD1_A: LD1.A R18.2
NetLD2_A: LD2.A R20.2
NetLD3_A: LD3.A R21.2
NetLD4_K: LD4.K R22.2
NetR16_1: R16.1 SB1.2
NetR16_2: R16.2 R38.2 U21.1(IN+)
NetR18_1: R18.1 U21.3(IN-) U21.4(OUT)
NetR20_1: R20.1 ; port LED2
NetR21_1: R21.1 R22.1 ; port LED3(WIFI) & LED4(BLE)
NetSB3_1: SB3.1 ; port BUTTON_EXTI13
NetSB12_2: SB12.2 SB14.2 ; port PMOD-UART2_TX/SPI2_CSN
NetSB15_2: SB15.2 SB16.2 ; port PMOD-UART2_RTS/SPI2_MOSI
NetSB18_2: SB18.2 SB19.2 ; port PMOD-UART2_CTS/SPI2_MISO
NetSB20_1: SB20.1 ; port PMOD-UART2_RX
NetSB21_1: SB21.1 ; port PMOD-SPI2_SCK

Not connected (* = marked no-connect by the designer): CN10 9* 10*

### Notes on the sheet
- RESET BUTTON
- USER & WAKE-UP Button
- 100nF should be place close to the MCU
  10pF and 1K should be place close to the button
- USER LED
- The 2 LEDs are top side
- PMOD
- (near LD3) WIFI
- (near LD4) BLE
- Designed by DiZiC
- Title:
- Project:
- Size:
- Date:
- A4
- Reference:
- Sheet:
- Revision:
- of
- (in symbol TSV631AILT) VCC+; VCC-

### Library data of the parts
B1 B2 = SW-PB_2: Push-button SMD; Order code RS: 102-412
C34-C37 C73 = CAP_NPOL: Capacitor_not polarized
CN10 = HEADER_2X6_PMOD: PMOD Connector Warning Specific Pinout
LD1-LD4 = LED: Light-Emitting Diode; Part Number A: *
R16 R18-R24 R38 = RES: Resistor
SB1-SB3 SB12 SB14-SB16 SB18-SB21 = Strap2: Solder Jumper; Solder: YES; Published: 24-Mar-1999; Revision: July-2002: Re-released for DXP Platform.; Publisher: Altium Limited
U21 = TSV631AILT: TSV631AILT  Rail-to-rail input/output, 60 µA, 880 kHz, 5 V CMOS  operational amplifiers

## Sheet MB1297_NFC_SAFE.SchDoc: NFC & ST-SAFE Part
size A4; DocumentNumber: MB1297; Revision: C; SheetNumber: 7; SheetTotal: 11
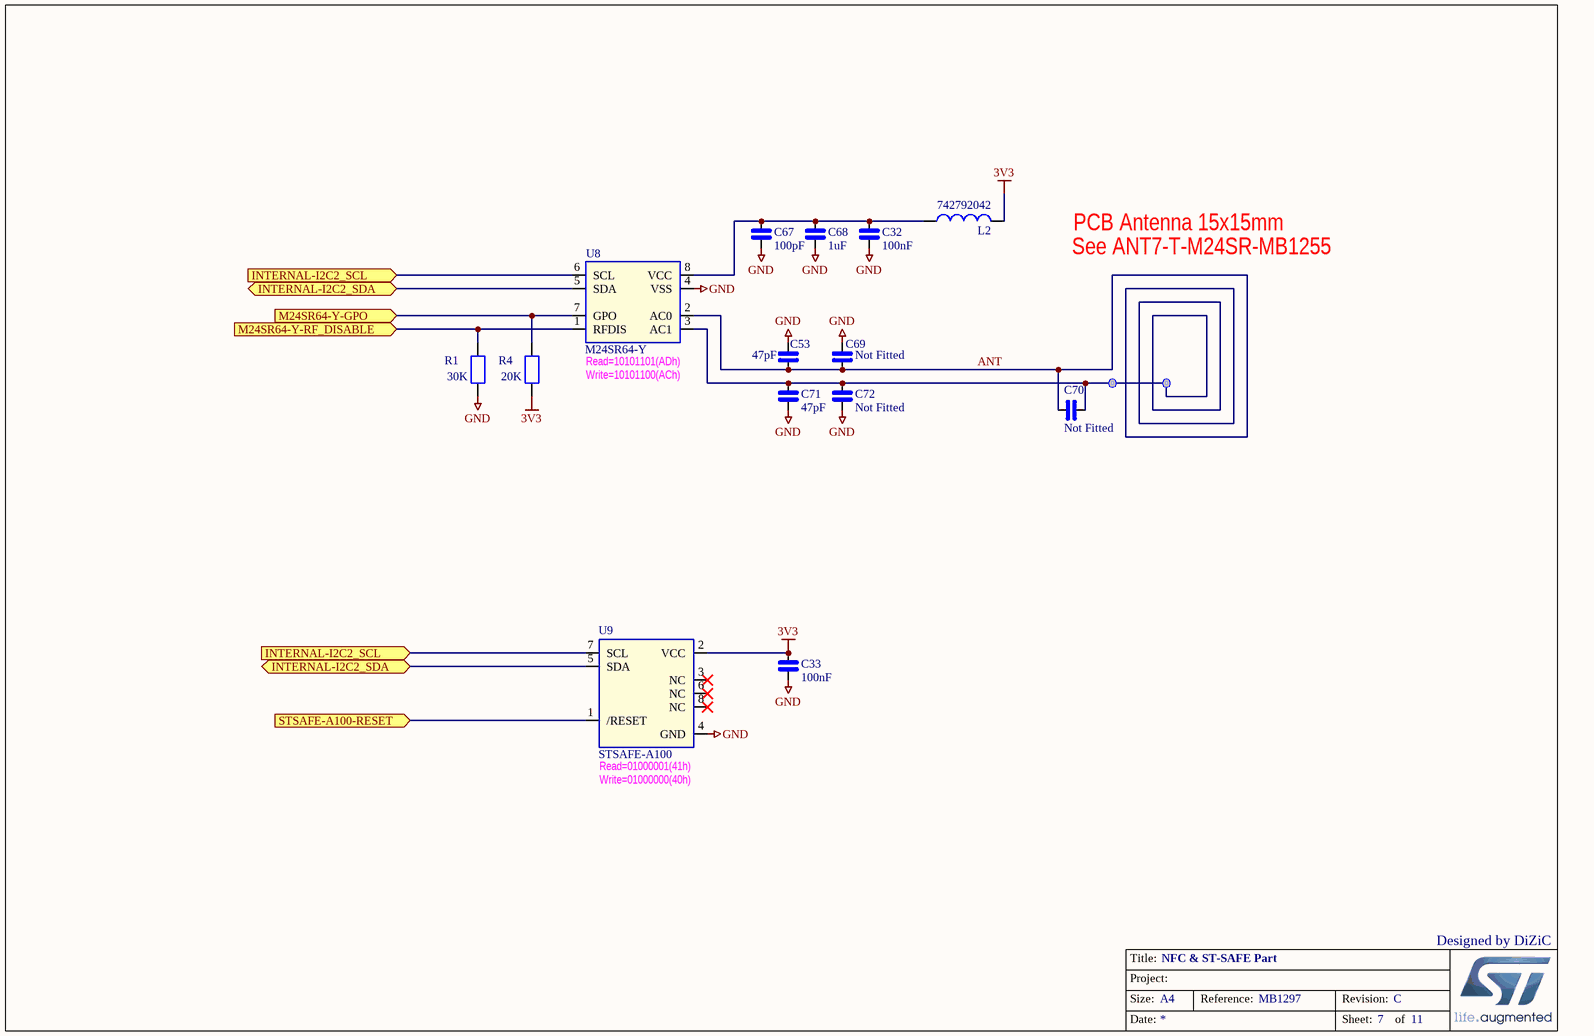
[diagram p5: MB1297_NFC_SAFE.SchDoc]

### Parts
C32  100nF  [0402_CAP_NPOL]
C33  100nF  [0402_CAP_NPOL]
C53  47pF  [0402_CAP_NPOL]
C67  100pF  [0402_CAP_NPOL]
C68  1uF  [0402_CAP_NPOL]
C69  Not Fitted  [0402_CAP_NPOL]
C70  Not Fitted  [0402_CAP_NPOL]
C71  47pF  [0402_CAP_NPOL]
C72  Not Fitted  [0402_CAP_NPOL]
L2  742792042  [0603L]
R1  30K  [0402_RES]
R4  20K  [0402_RES]
U8  M24SR64-Y  [SOP8]
U9  STSAFE-A100  [SOP8]

### Ports
INTERNAL-I2C2_SCL, INTERNAL-I2C2_SDA, M24SR64-Y-GPO, M24SR64-Y-RF_DISABLE, STSAFE-A100-RESET

### Nets
3V3: C33.1 L2.2 R4.1 U9.2(VCC)
GND: C32.2 C33.2 C53.2 C67.2 C68.2 C69.2 C71.2 C72.2 R1.1 U8.4(VSS) U9.4(GND)
ANT: C53.1 C69.1 C70.1 C70.2 C71.1 C72.1 U8.2(AC0) U8.3(AC1)
NetC32_1: C32.1 C67.1 C68.1 L2.1 U8.8(VCC)
NetR1_2: R1.2 U8.1(RFDIS) ; port M24SR64-Y-RF_DISABLE
NetR4_2: R4.2 U8.7(GPO) ; port M24SR64-Y-GPO
NetR10_2: U8.6(SCL) U9.7(SCL) ; port INTERNAL-I2C2_SCL
NetR11_2: U8.5(SDA) U9.5(SDA) ; port INTERNAL-I2C2_SDA
NetU1_88: U9.1(/RESET) ; port STSAFE-A100-RESET

Not connected (* = marked no-connect by the designer): U9 3(NC)* 6(NC)* 8(NC)*

### Notes on the sheet
- PCB Antenna 15x15mm
- See ANT7-T-M24SR-MB1255
- (near U8) Read=10101101(ADh)
- Write=10101100(ACh)
- (near U9) Read=01000001(41h)
- (near U9) Write=01000000(40h)
- Designed by DiZiC
- Title:
- Project:
- Size:
- Date:
- A4
- Reference:
- Sheet:
- Revision:
- of

### Library data of the parts
C32 C33 C53 C67-C72 = CAP_NPOL: Capacitor_not polarized
L2 = Inductor: Value: 100uH; Published: 8-Jun-2000; Revision: July-2002: Re-released for DXP Platform.; Publisher: Altium Limited
R1 R4 = RES: Resistor
U8 = M24SR64-Y: M24SR64-Y  64K_EEPROM NFC/RFID

## Sheet MB1297_STLINK_V2-1.SCHDOC: ST-LINK/V2-1 with support of SWD only
size A4; DocumentNumber: MB1297; Revision: C; SheetNumber: 11; SheetTotal: 11
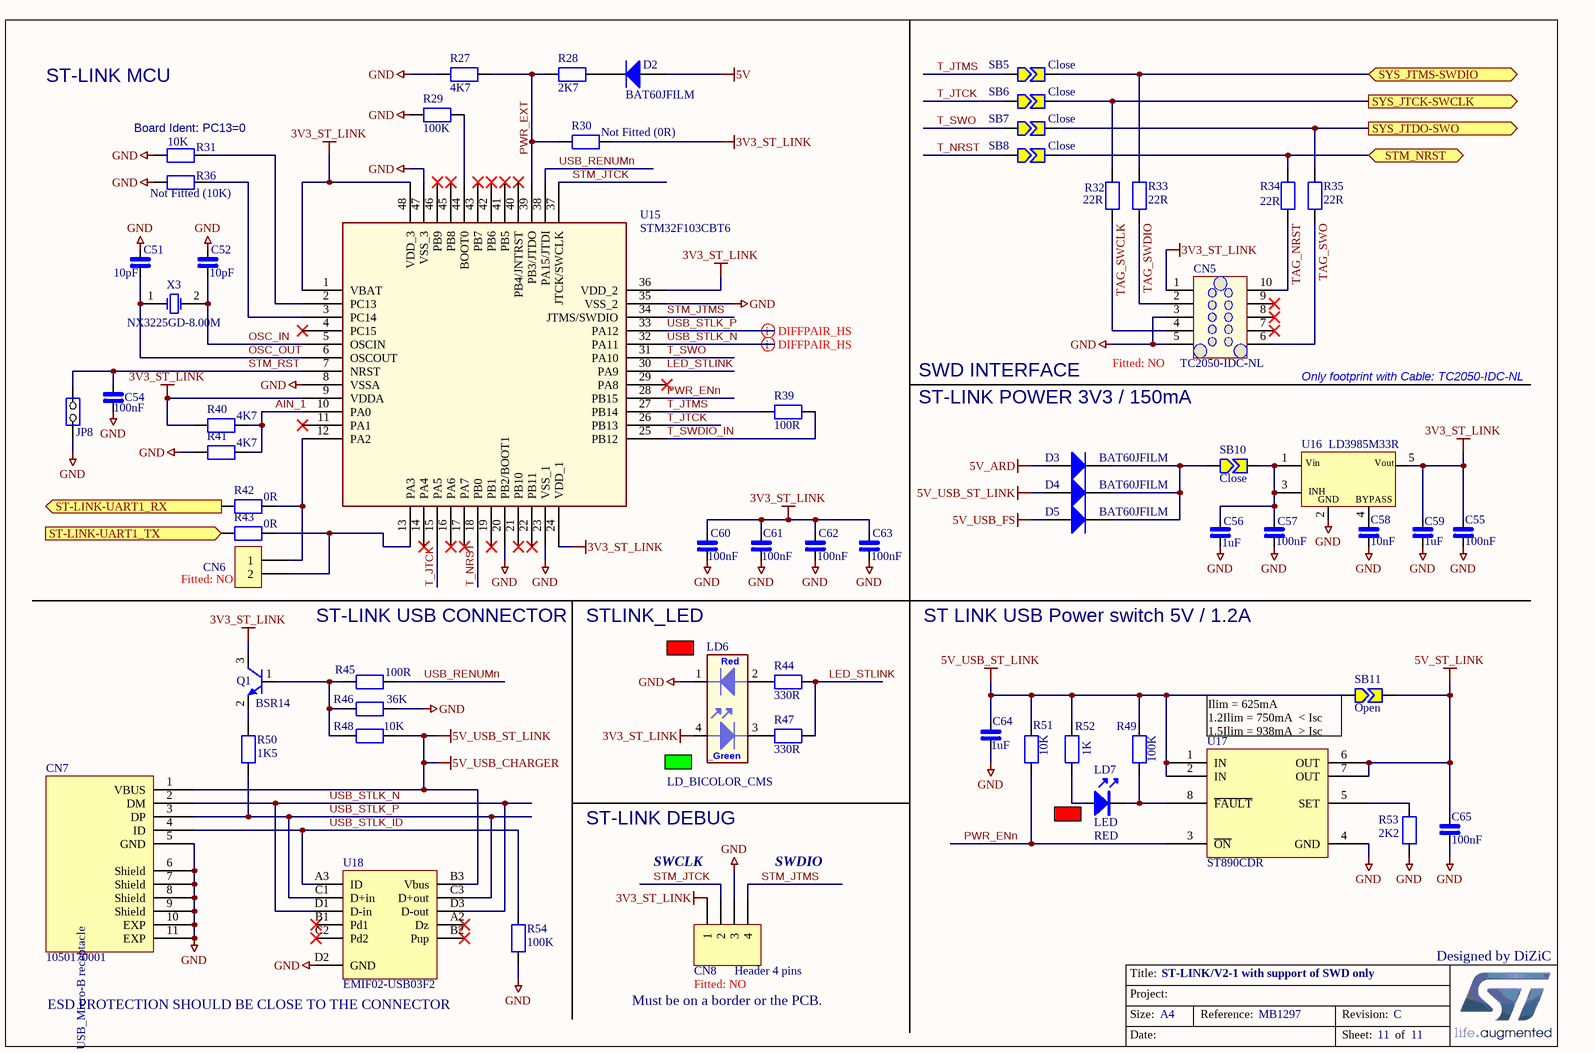
[diagram p6: MB1297_STLINK_V2-1.SCHDOC]

### Parts
C51  10pF  [0402_CAP_NPOL]
C52  10pF  [0402_CAP_NPOL]
C54  100nF  [0402_CAP_NPOL]
C55  100nF  [0402_CAP_NPOL]
C56  1uF  [0402_CAP_NPOL]
C57  100nF  [0402_CAP_NPOL]
C58  10nF  [0402_CAP_NPOL]
C59  1uF  [0402_CAP_NPOL]
C60  100nF  [0402_CAP_NPOL]
C61  100nF  [0402_CAP_NPOL]
C62  100nF  [0402_CAP_NPOL]
C63  100nF  [0402_CAP_NPOL]
C64  1uF  [0402_CAP_NPOL]
C65  100nF  [0402_CAP_NPOL]
CN5  TC2050-IDC-NL  Fitted: NO  [CON_TAG-C_TC2050-IDC-NL]
CN6  Fitted: NO  [CON_SAMTEC_TSW-102-07-G-S]  (hidden comment: header 2 pins 2.54mm)
CN7  1050170001  [CON_USBMICROB_MOLEX_105017-0001_H2P90]
CN8  Header 4 pins  Fitted: NO  [CON_SAMTEC_TSW-104-07-G-S]
D2  BAT60JFILM  [DIO_SOD323]
D3  BAT60JFILM  [DIO_SOD323]
D4  BAT60JFILM  [DIO_SOD323]
D5  BAT60JFILM  [DIO_SOD323]
JP8  Jumper_2.54mm  [CON_SAMTEC_TSW-102-07-G-S]  (value not drawn)
LD6  LD_BICOLOR_CMS  [LED_BI-GR_HSMF-A201-A00J1]
LD7  LED  Color: RED  [0603_LED_RED]
Q1  BSR14  [SOT23-3]
R27  4K7  [0402_RES]
R28  2K7  [0402_RES]
R29  100K  [0402_RES]
R30  Not Fitted (0R)  [0402_RES]
R31  10K  [0402_RES]
R32  22R  [0402_RES]
R33  22R  [0402_RES]
R34  22R  [0402_RES]
R35  22R  [0402_RES]
R36  Not Fitted (10K)  [0402_RES]
R39  100R  [0402_RES]
R40  4K7  [0402_RES]
R41  4K7  [0402_RES]
R42  0R  [0402_RES]
R43  0R  [0402_RES]
R44  330R  [0402_RES]
R45  100R  [0402_RES]
R46  36K  [0402_RES]
R47  330R  [0402_RES]
R48  10K  [0402_RES]
R49  100K  [0402_RES]
R50  1K5  [0402_RES]
R51  10K  [0402_RES]
R52  1K  [0402_RES]
R53  2K2  [0402_RES]
R54  100K  [0402_RES]
SB5  Close  [SB]
SB6  Close  [SB]
SB7  Close  [SB]
SB8  Close  [SB]
SB10  Close  [SB]
SB11  Open  [SB]
U15  STM32F103CBT6  [ICC_LQFP48_7X7_P050]
U16  LD3985M33R  [REG_SOT23-5L]
U17  ST890CDR  [ICC_SO8_5X4_P127]
U18  EMIF02-USB03F2  [ESD_FLIP-CHIP-BGA11_1P44X1P94_P050]
X3  NX3225GD-8.00M  [CRY_NX3225GD_2P]

### Ports
ST-LINK-UART1_RX, ST-LINK-UART1_TX, STM_NRST, SYS_JTCK-SWCLK, SYS_JTDO-SWO, SYS_JTMS-SWDIO

### Nets
3V3_ST_LINK: C55.1 C59.1 C60.1 C61.1 C62.1 C63.1 CN5.1 CN8.1 LD6.4 Q1.3(C) R30.1 R40.2 U15.1(VBAT) U15.9(VDDA) U15.24(VDD_1) U15.36(VDD_2) U15.48(VDD_3) U16.5(Vout)
5V: D2.1(A)
5V_ARD: D3.1(A)
5V_ST_LINK: C65.1 SB11.1 U17.6(OUT) U17.7(OUT)
5V_USB_CHARGER: C64.1 CN7.1(VBUS) D4.1(A) R48.1 R49.2 R51.2 R52.2 SB11.2 U17.1(IN) U17.2(IN) U18.B3(Vbus)  [also labelled 5V_USB_ST_LINK]
5V_USB_FS: D5.1(A)
GND: C51.1 C52.1 C54.2 C55.2 C56.2 C57.2 C58.2 C59.2 C60.2 C61.2 C62.2 C63.2 C64.2 C65.2 CN5.3 CN5.5 CN7.5(GND) CN7.6(Shield) CN7.7(Shield) CN7.8(Shield) CN7.9(Shield) CN7.10(EXP) CN7.11(EXP) CN8.3 JP8.1(COMMON) LD6.1 R27.2 R29.2 R31.2 R36.2 R41.2 R46.1 R53.1 R54.2 U15.8(VSSA) U15.20(PB2/BOOT1) U15.23(VSS_1) U15.35(VSS_2) U15.47(VSS_3) U16.2(GND) U17.4(GND) U18.D2(GND)
AIN_1: R40.1 R41.1 U15.10(PA0)
LED_STLINK: R44.1 R47.1 U15.30(PA9)
OSC_IN: C52.2 U15.5(OSCIN) X3.2(OSC2)
OSC_OUT: C51.2 U15.6(OSCOUT) X3.1(OSC1)
PWR_ENn: R51.1 U15.28(PB15) U17.3(~{ON})
PWR_EXT: R27.1 R28.2 R30.2 U15.39(PB3/JTDO)
STM_JTCK: CN8.2 U15.37(JTCK/SWCLK)
STM_JTMS: CN8.4 U15.34(JTMS/SWDIO)
STM_RST: C54.1 JP8.2(NO) U15.7(NRST)
T_JTCK: SB6.2 U15.15(PA5) U15.26(PB13)
T_JTMS: R39.2 SB5.2 U15.27(PB14)
T_NRST: SB8.2 U15.18(PB0)
T_SWDIO_IN: R39.1 U15.25(PB12)
T_SWO: SB7.2 U15.31(PA10)
TAG_NRST: CN5.10 R34.1
TAG_SWCLK: CN5.4 R32.1
TAG_SWDIO: CN5.2 R33.1
TAG_SWO: CN5.6 R35.1
USB_RENUMn: R45.1 U15.38(PA15/JTDI)
USB_STLK_ID: CN7.4(ID) R54.1 U18.A3(ID)
USB_STLK_N: CN7.2(DM) U15.32(PA11) U18.D1(D-in) U18.D3(D-out)
USB_STLK_P: CN7.3(DP) R50.2 U15.33(PA12) U18.C1(D+in) U18.C3(D+out)
NetC56_1: C56.1 C57.1 SB10.1 U16.1(Vin) U16.3(CE)
NetC58_1: C58.1 U16.4(BYPASS)
NetCN6_1: CN6.1 R42.1 U15.12(PA2)
NetCN6_2: CN6.2 R43.1 U15.13(PA3)
NetD2_2: D2.2(K) R28.1
NetD3_2: D3.2(K) D4.2(K) D5.2(K) SB10.2
NetLD6_2: LD6.2 R44.2
NetLD6_3: LD6.3 R47.2
NetLD7_A: LD7.A R52.1
NetLD7_K: LD7.K R49.1 U17.8(~{FAULT})
NetQ1_1: Q1.1(B) R45.2 R46.2 R48.2
NetQ1_2: Q1.2(E) R50.1
NetR29_1: R29.1 U15.44(BOOT0)
NetR31_1: R31.1 U15.2(PC13)
NetR32_2: R32.2 SB6.1 ; port SYS_JTCK-SWCLK
NetR33_2: R33.2 SB5.1 ; port SYS_JTMS-SWDIO
NetR34_2: R34.2 SB8.1 ; port STM_NRST
NetR35_2: R35.2 SB7.1 ; port SYS_JTDO-SWO
NetR36_1: R36.1 U15.3(PC14)
NetR42_2: R42.2 ; port ST-LINK-UART1_RX
NetR43_2: R43.2 ; port ST-LINK-UART1_TX
NetR53_2: R53.2 U17.5(SET)

Not connected (* = marked no-connect by the designer): CN5 7* 8* 9*; U15 4(PC15)* 11(PA1)* 14(PA4)* 16(PA6)* 17(PA7)* 19(PB1)* 21(PB10)* 22(PB11)* 29(PA8)* 40(PB4/JNTRST)* 41(PB5)* 42(PB6)* 43(PB7)* 45(PB8)* 46(PB9)*; U18 A2(Dz)* B1(Pd1)* B2(Pup)* C2(Pd2)*

### Layout directives
differential pair: USB_STLK_N, USB_STLK_P

### Notes on the sheet
- ST-LINK MCU
- (near R31) Board Ident: PC13=0
- SWD INTERFACE
- Only footprint with Cable: TC2050-IDC-NL
- ST-LINK POWER 3V3 / 150mA
- ST-LINK USB CONNECTOR
- STLINK_LED
- ST LINK USB Power switch 5V / 1.2A
- (near SB11) Ilim = 625mA
  1.2Ilim = 750mA  < Isc
  1.5Ilim = 938mA  > Isc
- ST-LINK DEBUG
- SWCLK
- SWDIO
- Must be on a border or the PCB.
- Designed by DiZiC
- (near U18) ESD PROTECTION SHOULD BE CLOSE TO THE CONNECTOR
- Title:
- Project:
- Size:
- Date:
- A4
- Reference:
- Sheet:
- Revision:
- of
- (in symbol 1050170001) USB_Micro-B receptacle
- (in symbol LD3985M33R) INH
- (in symbol LD_BICOLOR_CMS) Red; _Green

### Library data of the parts
C51 C52 C54-C65 = CAP_NPOL: Capacitor_not polarized
CN5 = Tag-10-C: Tag_Connector Header, 10-Pin, Dual row No legs; Manuf_Part_1: TC2050-IDC-NL-FP; Ordered_By: Subcon; Distrib: *; ECCN_US/EU: n/a; Manuf_1: Tag_connect; Order_code: *; Value: TC2050-IDC-NL
CN6 = Header 2 pins: Manuf_1: SAMTEC; Manuf_Part_2: 4711955140470; Manuf_2: KONTEC; Manuf_Part_1: TSW-102-07-x-S; Order_Code: 423-2841; Ordered_By: Subcon; ECCN_US/EU: n/a; Value: header 2 pins 2.54mm
CN7 = 1050170001: USB-MICRO-B, 1050170001, SMT, MOLEX; Fitted: YES; Ordered_By: Subcon; ECCN_US/EU: n/a; Manuf_1: MOLEX; Manuf_Part_1: 1050170001; Distrib: DIGIKEY; Value: 1050170001; Order_Code: *
CN8 = Header 4: Header, 4-Pin; Manuf_1: Samtec; Manuf_Part_1: TSW-104-07-x-S; Ordered_By: Subcon; ECCN_US/EU: n/a; Distrib: *; Order_Code: *; Value: Header 4 pins
D2-D5 = BAT60JFILM: Manuf_1: STM; ECCN_US/EU: EAR99/NEC; Ref St: 9151097; Fitted: YES; Manuf_Part_1: BAT60JFILM; Distrib: ST; Order_Code: BAT60JFILM; Ordered_By: STM
JP8 = TSW-102-07-x-S: Connector jumper 1 position; Manuf_1: SAMTEC; Manuf_Part_2: 4711955140470; Manuf_2: KONTEC; Order_Code: 423-2841; Fitted: YES; Ordered_By: Subcon; ECCN_US/EU: n/a; Value: Jumper_2.54mm; Manuf_Part_1: TSW-102-07-x-S
LD6 = LD_BICOLOR_CMS: Bicolor Led; Manuf_Part_1: HSMF-A201-A00J1; Manuf_1: Avago Technologies; Manuf_2: everluck; Manuf_Part_2: LE-RGW35280; ECCN_US/EU: EAR99/NEC; Fitted: YES; Ordered_By: Subcon; Distrib: RADIOSPARES; Value: LD_BICOLOR_CMS
LD7 = LED: Light-Emitting Diode; Part Number A: *
Q1 = BSR14: BSR14 NPN switching transistor SOT23 (Marking U8)
R27-R29 R31-R35 R39-R54 = RES: Resistor
R30 R36 = RES: Resistor; FITTED: NO
SB5-SB8 SB10 SB11 = Strap2: Solder Jumper; Solder: YES; Published: 24-Mar-1999; Revision: July-2002: Re-released for DXP Platform.; Publisher: Altium Limited
U15 = STM32F103CBT6: Medium-density performance line ARM-based 32-bit MCU with 128KB Flash; Manuf_1: STM; ECCN_US/EU: 3A991A2/NEC; Fitted: YES; Manuf_Part_1: STM32F103CBT6; Distrib: STM; Order_Code: STM32F103CBT6; Ordered_By: STM; Value: STM32F103CBT6
U16 = LD3985M33R: Ultra low drop-low noise BiCMOS voltage, regulators low ESR capacitors compatible; Manuf_1: STM; Ref St: 9176161; ECCN_US/EU: EAR99/NEC; Fitted: YES; Manuf_Part_1: LD3985M33R; Distrib: STM; Ordered_By: STM; Order_Code: LD3985M33R; Value: LD3985M33R
U17 = ST890CDR: 1.2 A current limited high-side power switch with thermal shutdown; Manuf_1: STM; ECCN_US/EU: EAR99/NEC; Fitted: YES; Manuf_Part_1: ST890CDR; Distrib: STM; Ordered_By: STM; Order_Code: *; Value: ST890CDR
U18 = EMIF02-USB03F2: 2-line IPAD, EMI filter including ESD protection; Manuf_1: STM; ECCN_US/EU: EAR99/NEC; Fitted: YES; REF_STM: 9179037; Manuf_Part_1: EMIF02-USB03F2; Distrib: ST; Order_code: EMIF02-USB03F2; Ordered_By: STM; Value: EMIF02-USB03F2
X3 = XTAL_8M_NX3225GD: Crystal 8Mhz, 8pF, -+50PPM, SMD; Manuf_1: NDK; Manuf_Part_1: NX3225GD 8MHz EXS00A-CG04874; ECCN_US/EU: EAR99/NEC; NDK Ref: X3127326; Ref St: 9157029; Fitted: YES; Ordered_By: STM; Order_Code: NX3225GD 8MHz EXS00A-CG04874; Distrib: *; Value: NX3225GD-8.00M

## Sheet MB1297_Arduino.SchDoc: Arduino Uno connector
size A4; DocumentNumber: MB1297; Revision: C; SheetNumber: 9; SheetTotal: 11
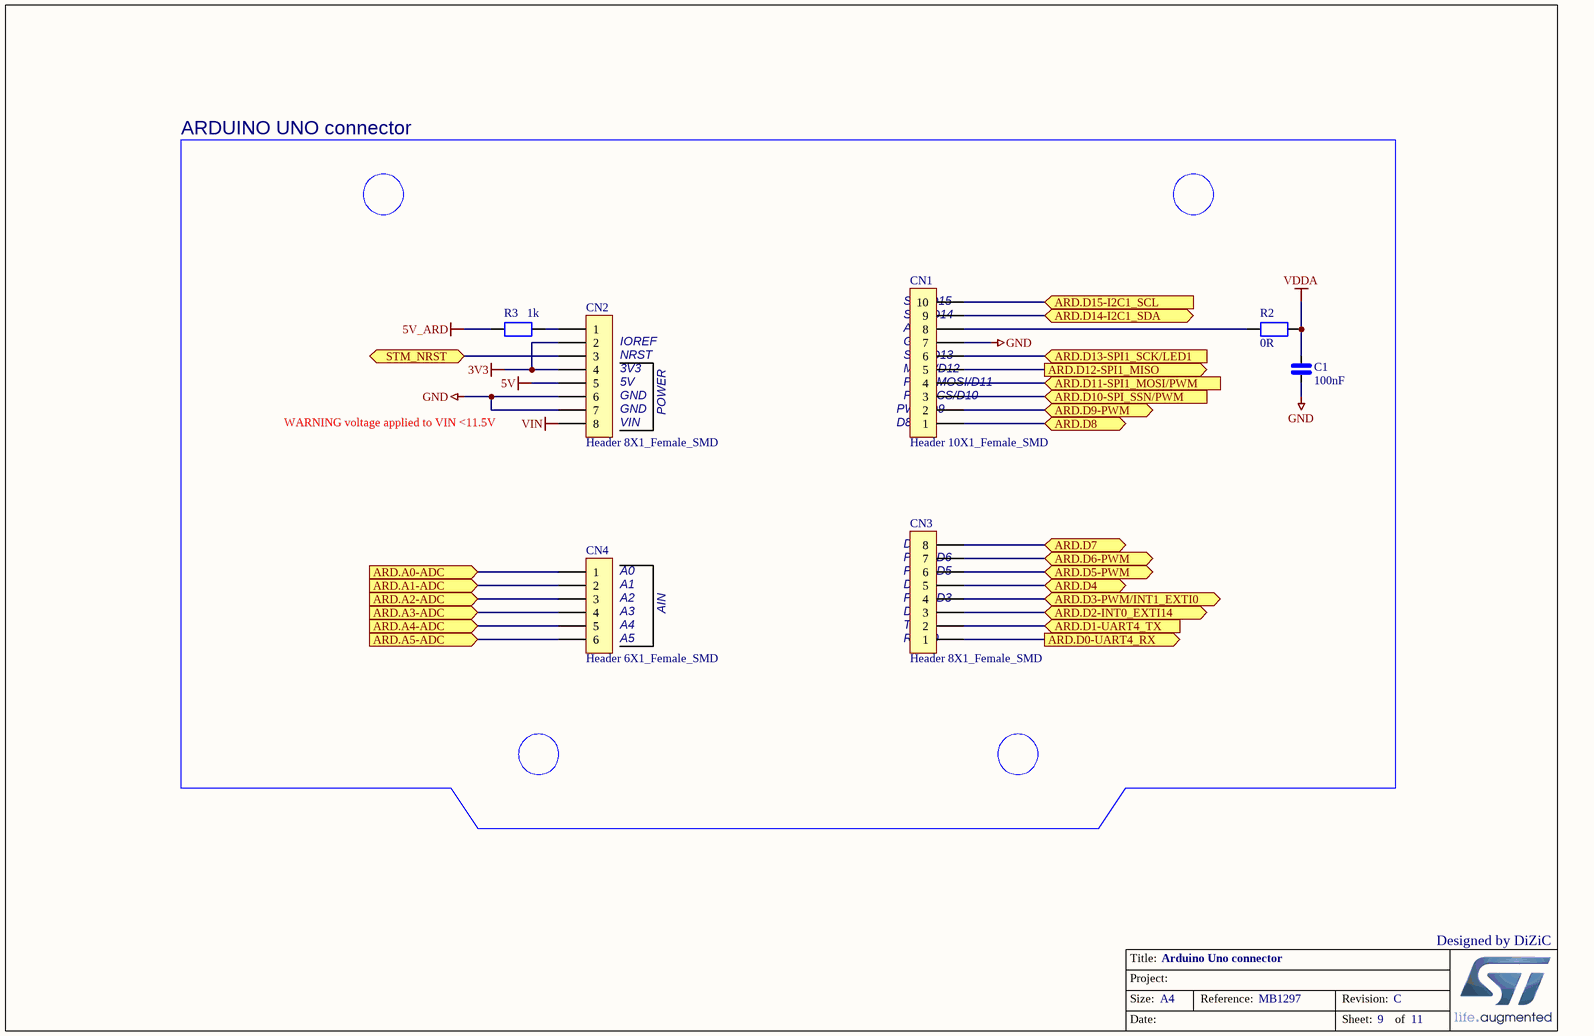
[diagram p7: MB1297_Arduino.SchDoc]

### Parts
C1  100nF  [0402_CAP_NPOL]
CN1  Header 10X1_Female_SMD  [F-V50XC-1X10R-LF]
CN2  Header 8X1_Female_SMD  [F-V50XC-1X08R-LF]
CN3  Header 8X1_Female_SMD  [F-V50XC-1X08R-LF]
CN4  Header 6X1_Female_SMD  [F-V50XC-1X06R-LF]
R2  0R  [0402_RES]
R3  1k  [0402_RES]

### Ports
ARD.A0-ADC, ARD.A1-ADC, ARD.A2-ADC, ARD.A3-ADC, ARD.A4-ADC, ARD.A5-ADC, ARD.D0-UART4_RX, ARD.D1-UART4_TX, ARD.D2-INT0_EXTI14, ARD.D3-PWM/INT1_EXTI0, ARD.D4, ARD.D5-PWM, ARD.D6-PWM, ARD.D7, ARD.D8, ARD.D9-PWM, ARD.D10-SPI_SSN/PWM, ARD.D11-SPI1_MOSI/PWM, ARD.D12-SPI1_MISO, ARD.D13-SPI1_SCK/LED1, ARD.D14-I2C1_SDA, ARD.D15-I2C1_SCL, STM_NRST

### Nets
3V3: CN2.2 CN2.4
5V: CN2.5
5V_ARD: R3.1
GND: C1.2 CN1.7 CN2.6 CN2.7
VDDA: C1.1 R2.2
VIN: CN2.8
NetC3_2: CN2.3 ; port STM_NRST
NetCN1_1: CN1.1 ; port ARD.D8
NetCN1_2: CN1.2 ; port ARD.D9-PWM
NetCN1_3: CN1.3 ; port ARD.D10-SPI_SSN/PWM
NetCN1_4: CN1.4 ; port ARD.D11-SPI1_MOSI/PWM
NetCN1_5: CN1.5 ; port ARD.D12-SPI1_MISO
NetCN1_6: CN1.6 ; port ARD.D13-SPI1_SCK/LED1
NetCN1_8: CN1.8 R2.1
NetCN1_9: CN1.9 ; port ARD.D14-I2C1_SDA
NetCN1_10: CN1.10 ; port ARD.D15-I2C1_SCL
NetCN2_1: CN2.1 R3.2
NetCN3_1: CN3.1 ; port ARD.D0-UART4_RX
NetCN3_2: CN3.2 ; port ARD.D1-UART4_TX
NetCN3_3: CN3.3 ; port ARD.D2-INT0_EXTI14
NetCN3_4: CN3.4 ; port ARD.D3-PWM/INT1_EXTI0
NetCN3_5: CN3.5 ; port ARD.D4
NetCN3_6: CN3.6 ; port ARD.D5-PWM
NetCN3_7: CN3.7 ; port ARD.D6-PWM
NetCN3_8: CN3.8 ; port ARD.D7
NetCN4_1: CN4.1 ; port ARD.A0-ADC
NetCN4_2: CN4.2 ; port ARD.A1-ADC
NetCN4_3: CN4.3 ; port ARD.A2-ADC
NetCN4_4: CN4.4 ; port ARD.A3-ADC
NetCN4_5: CN4.5 ; port ARD.A4-ADC
NetCN4_6: CN4.6 ; port ARD.A5-ADC

### Notes on the sheet
- ARDUINO UNO connector
- (near CN1) SCL/D15
- (near CN2) IOREF
- (near CN2) NRST
- (near CN2) 3V3
- (near CN2) 5V
- (near CN1) SDA/D14
- (near CN1) SCK/D13
- (near CN1) MISO/D12
- (near CN1) PWM/MOSI/D11
- (near CN1) AVDD
- (near CN1) GND
- WARNING voltage applied to VIN <11.5V
- (near CN2) GND
- (near CN2) VIN
- POWER
- (near CN1) D8
- (near CN1) PWM/D9
- (near CN1) PWM/CS/D10
- (near CN4) A0
- (near CN3) PWM/D5
- (near CN3) PWM/D6
- (near CN3) D7
- (near CN4) A1
- (near CN4) A2
- (near CN4) A3
- (near CN4) A4
- (near CN4) A5
- AIN
- (near CN3) RX/D0
- (near CN3) TX/D1
- (near CN3) D2
- (near CN3) D4
- (near CN3) PWM/D3
- Designed by DiZiC
- Title:
- Project:
- Size:
- Date:
- Reference:
- Sheet:
- Revision:
- of

### Library data of the parts
C1 = CAP_NPOL: Capacitor_not polarized
CN1 = Header 10X1_Female_SMD: Header, 10-Pin, SMD, Single row,female; LatestRevisionDate: 17-Jul-2002; LatestRevisionNote: Re-released for DXP Platform.; Publisher: Altium Limited
CN2 CN3 = Header 8X1_Female_SMD: Header, 8-Pin, SMD, Single row,female; LatestRevisionDate: 17-Jul-2002; LatestRevisionNote: Re-released for DXP Platform.; Publisher: Altium Limited
CN4 = Header 6X1_Female_SMD: Header, 6-Pin, SMD, Single row,female; LatestRevisionDate: 17-Jul-2002; LatestRevisionNote: Re-released for DXP Platform.; Publisher: Altium Limited
R2 R3 = RES: Resistor

## Sheet MB1297_MEMS.SchDoc: MEMS Sensors
size A4; DocumentNumber: MB1297; Revision: C; SheetNumber: 6; SheetTotal: 11
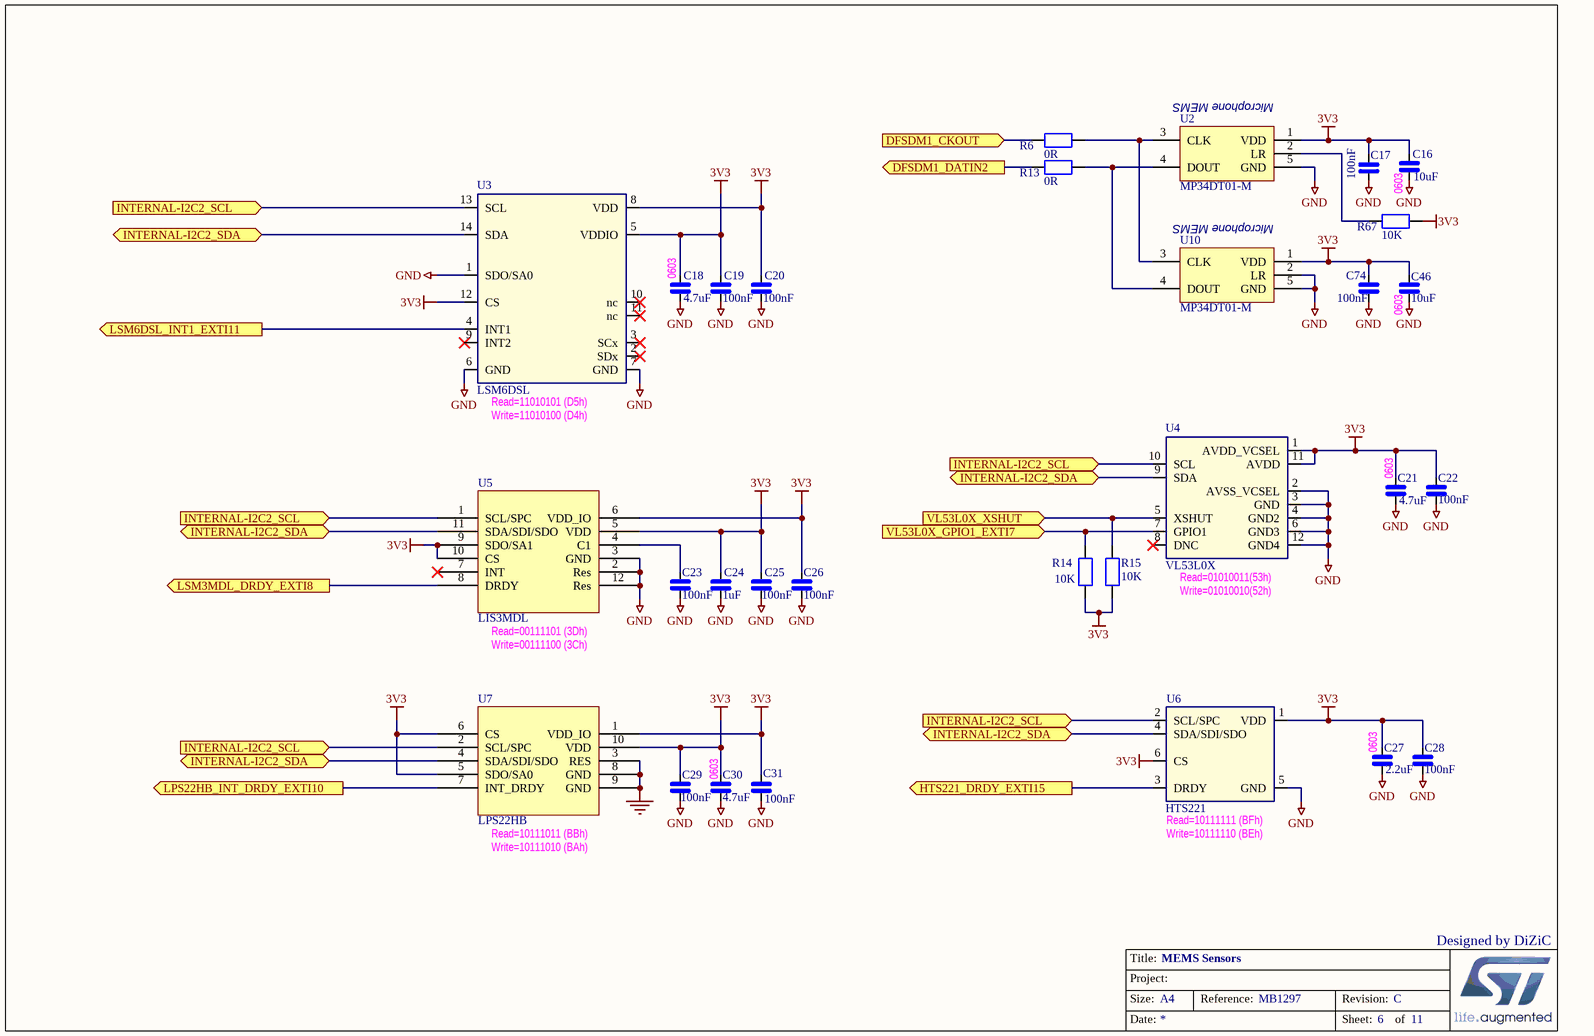
[diagram p8: MB1297_MEMS.SchDoc]

### Parts
C16  10uF  [0603_CAP_NPOL]
C17  100nF  [0402_CAP_NPOL]
C18  4.7uF  [0603_CAP_NPOL]
C19  100nF  [0402_CAP_NPOL]
C20  100nF  [0402_CAP_NPOL]
C21  4.7uF  [0603_CAP_NPOL]
C22  100nF  [0402_CAP_NPOL]
C23  100nF  [0402_CAP_NPOL]
C24  1uF  [0402_CAP_NPOL]
C25  100nF  [0402_CAP_NPOL]
C26  100nF  [0402_CAP_NPOL]
C27  2.2uF  [0603_CAP_NPOL]
C28  100nF  [0402_CAP_NPOL]
C29  100nF  [0402_CAP_NPOL]
C30  4.7uF  [0603_CAP_NPOL]
C31  100nF  [0402_CAP_NPOL]
C46  10uF  [0603_CAP_NPOL]
C74  100nF  [0402_CAP_NPOL]
R6  0R  [0402_RES]
R13  0R  [0402_RES]
R14  10K  [0402_RES]
R15  10K  [0402_RES]
R67  10K  [0402_RES]
U2  MP34DT01-M  [HCLGA-4LD 3x4x1]
U3  LSM6DSL  [LGA14L-2.5X3X0.86p0.5]
U4  VL53L0X  [LGA12-optical]
U5  LIS3MDL  [VFLGA12-2x2x1]
U6  HTS221  [HLGA6L-2x2x0.9]
U7  LPS22HB  [HLGA10L-2X2X0.76]
U10  MP34DT01-M  [HCLGA-4LD 3x4x1]

### Ports
DFSDM1_CKOUT, DFSDM1_DATIN2, HTS221_DRDY_EXTI15, INTERNAL-I2C2_SCL, INTERNAL-I2C2_SDA, LPS22HB_INT_DRDY_EXTI10, LSM3MDL_DRDY_EXTI8, LSM6DSL_INT1_EXTI11, VL53L0X_GPIO1_EXTI7, VL53L0X_XSHUT

### Nets
3V3: C16.1 C17.2 C18.1 C19.1 C20.1 C21.1 C22.1 C24.1 C25.1 C26.1 C27.1 C28.1 C29.1 C30.1 C31.1 C46.1 C74.1 R14.1 R15.1 R67.1 U2.1(VDD) U3.5(VDDIO) U3.8(VDD) U3.12(CS) U4.1(AVDD_VCSEL) U4.11(AVDD) U5.5(VDD) U5.6(VDD_IO) U5.9(SDO/SA1) U5.10(CS) U6.1(VDD) U6.6(CS) U7.1(VDD_IO) U7.5(SDO/SA0) U7.6(CS) U7.10(VDD) U10.1(VDD)
GND: C16.2 C17.1 C18.2 C19.2 C20.2 C21.2 C22.2 C23.2 C24.2 C25.2 C26.2 C27.2 C28.2 C29.2 C30.2 C31.2 C46.2 C74.2 U2.5(GND) U3.1(SDO/SA0) U3.6(GND) U3.7(GND) U4.2(AVSS_VCSEL) U4.3(GND) U4.4(GND2) U4.6(GND3) U4.12(GND4) U5.2(Res) U5.3(GND) U5.12(Res) U6.5(GND) U7.3(RES) U7.8(GND) U7.9(GND) U10.2(LR) U10.5(GND)
NetC23_1: C23.1 U5.4(C1)
NetR6_1: R6.1 U2.3(CLK) U10.3(CLK)
NetR6_2: R6.2 ; port DFSDM1_CKOUT
NetR10_2: U3.13(SCL) U4.10(SCL) U5.1(SCL/SPC) U6.2(SCL/SPC) U7.2(SCL/SPC) ; port INTERNAL-I2C2_SCL
NetR11_2: U3.14(SDA) U4.9(SDA) U5.11(SDA/SDI/SDO) U6.4(SDA/SDI/SDO) U7.4(SDA/SDI/SDO) ; port INTERNAL-I2C2_SDA
NetR13_1: R13.1 U2.4(DOUT) U10.4(DOUT)
NetR13_2: R13.2 ; port DFSDM1_DATIN2
NetR14_2: R14.2 U4.7(GPIO1) ; port VL53L0X_GPIO1_EXTI7
NetR15_2: R15.2 U4.5(XSHUT) ; port VL53L0X_XSHUT
NetR67_2: R67.2 U2.2(LR)
NetU1_57: U7.7(INT_DRDY) ; port LPS22HB_INT_DRDY_EXTI10
NetU1_58: U3.4(INT1) ; port LSM6DSL_INT1_EXTI11
NetU1_62: U6.3(DRDY) ; port HTS221_DRDY_EXTI15
NetU1_65: U5.8(DRDY) ; port LSM3MDL_DRDY_EXTI8

Not connected (* = marked no-connect by the designer): U3 2(SDx)* 3(SCx)* 9(INT2)* 10(nc)* 11(nc)*; U4 8(DNC)*; U5 7(INT)*

### Notes on the sheet
- (near U2) Microphone MEMS
- (near U10) Microphone MEMS
- (near C16) 0603
- (near C18) 0603
- (near C46) 0603
- (near U3) Read=11010101 (D5h)
- (near U3) Write=11010100 (D4h)
- (near C21) 0603
- (near U4) Read=01010011(53h)
- (near U5) Read=00111101 (3Dh)
- Write=00111100 (3Ch)
- (near U4) Write=01010010(52h)
- (near C30) 0603
- (near C27) 0603
- (near U7) Read=10111011 (BBh)
- Write=10111010 (BAh)
- (near U6) Read=10111111 (BFh)
- (near U6) Write=10111110 (BEh)
- Designed by DiZiC
- Title:
- Project:
- Size:
- Date:
- A4
- Reference:
- Sheet:
- Revision:
- of

### Library data of the parts
C16-C31 C46 C74 = CAP_NPOL: Capacitor_not polarized
R6 R13-R15 R67 = RES: Resistor
U2 U10 = MP34DT01: MEMS audio microphone
U3 = LSM6DSL: Accelero + Gyro MEMS (6 Axis)
U4 = VL53L0X: Proximity sensor MEMS
U5 = LIS3MDL: IC,Sensor; Provider: MMCC; Vendor: ST; AsmInst: *; Category: IC; PartNumber: *
U6 = HTS221: Humidity + Temp MEMS
U7 = LPS22HB: IC,Sensor; Provider: MMCC; Vendor: ST; AsmInst: *; Category: IC; PartNumber: *

## Sheet MB1297_USB_OTG_FS.SchDoc: USB_OTG_FS
size A4; DocumentNumber: MB1297; Revision: C; SheetNumber: 4; SheetTotal: 11
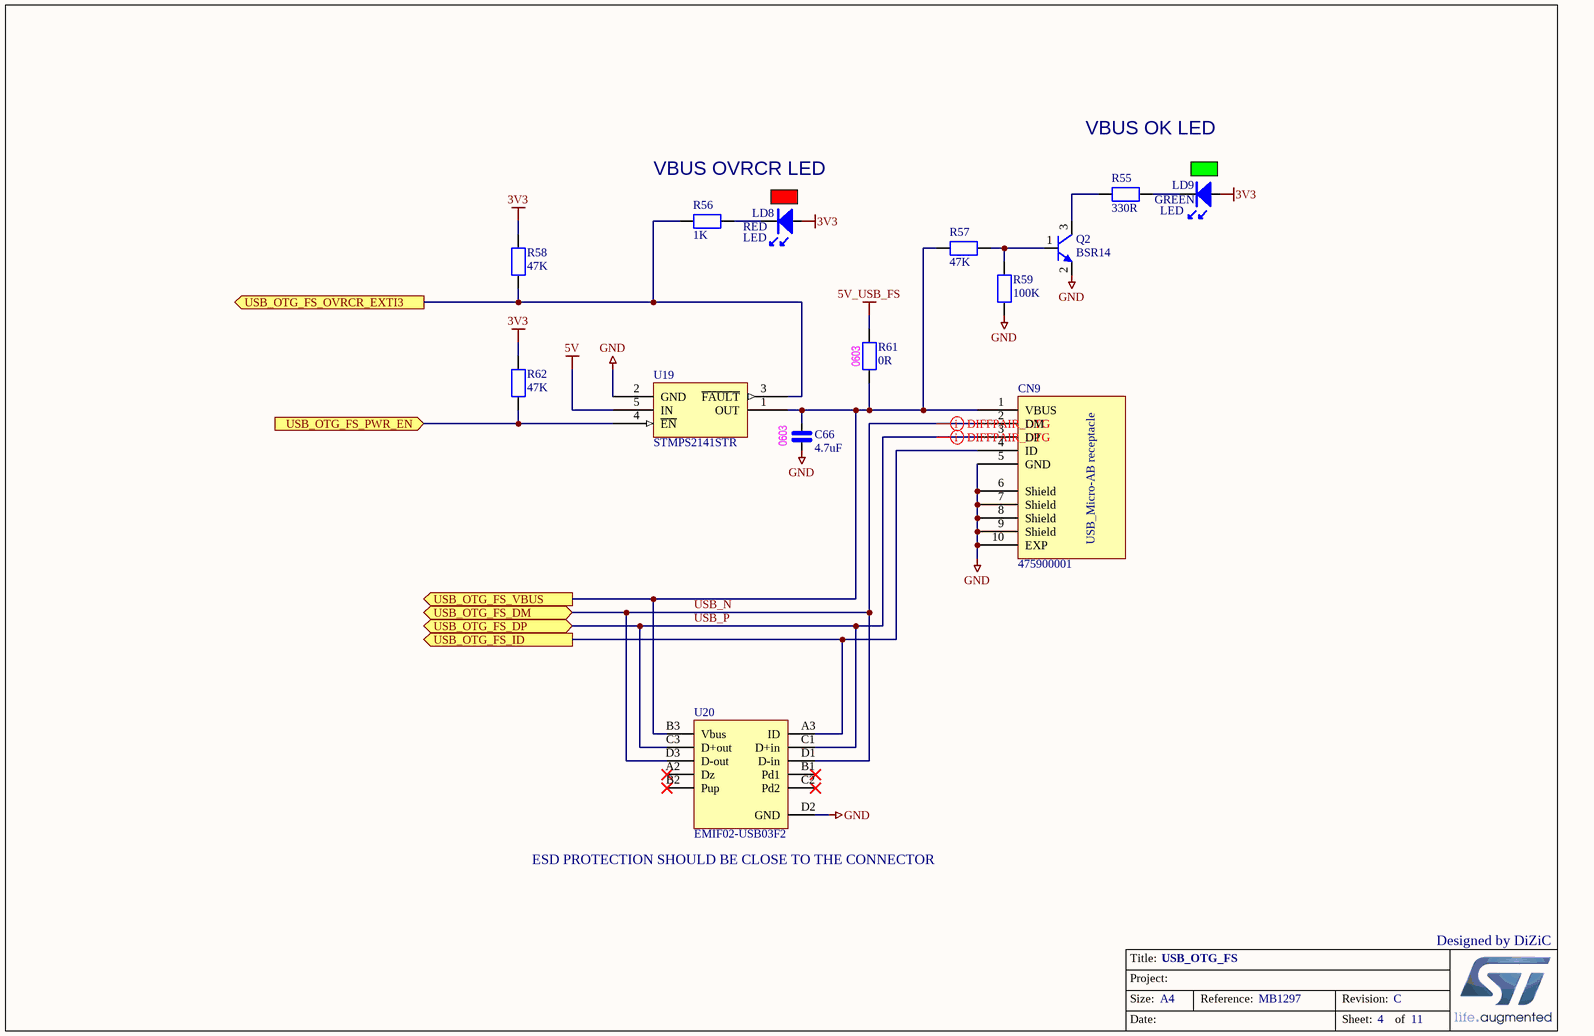
[diagram p9: MB1297_USB_OTG_FS.SchDoc]

### Parts
C66  4.7uF  [0603_CAP_NPOL]
CN9  475900001  [CON_USBMICROAB_MOLEX_47590-0001_H3]
LD8  LED  Color: RED  [0603_LED_RED]
LD9  LED  Color: GREEN  [0603_LED_GREEN]
Q2  BSR14  [SOT23-3]
R55  330R  [0402_RES]
R56  1K  [0402_RES]
R57  47K  [0402_RES]
R58  47K  [0402_RES]
R59  100K  [0402_RES]
R61  0R  [0603_RES]
R62  47K  [0402_RES]
U19  STMPS2141STR  [MOS_SOT23-5L]
U20  EMIF02-USB03F2  [ESD_FLIP-CHIP-BGA11_1P44X1P94_P050]

### Ports
USB_OTG_FS_DM (bidir), USB_OTG_FS_DP (bidir), USB_OTG_FS_ID (out), USB_OTG_FS_OVRCR_EXTI3 (out), USB_OTG_FS_PWR_EN (in), USB_OTG_FS_VBUS (out)

### Nets
3V3: LD8.A LD9.A R58.1 R62.1
5V: U19.5(IN)
5V_USB_FS: R61.1
GND: C66.2 CN9.5(GND) CN9.6(Shield) CN9.7(Shield) CN9.8(Shield) CN9.9(Shield) CN9.10(EXP) Q2.2(E) R59.1 U19.2(GND) U20.D2(GND)
USB_N: CN9.2(DM) U20.D1(D-in) U20.D3(D-out) ; port USB_OTG_FS_DM
USB_P: CN9.3(DP) U20.C1(D+in) U20.C3(D+out) ; port USB_OTG_FS_DP
NetC66_1: C66.1 CN9.1(VBUS) R57.1 R61.2 U19.1(OUT) U20.B3(Vbus) ; port USB_OTG_FS_VBUS
NetCN9_4: CN9.4(ID) U20.A3(ID) ; port USB_OTG_FS_ID
NetLD8_K: LD8.K R56.2
NetLD9_K: LD9.K R55.2
NetQ2_1: Q2.1(B) R57.2 R59.2
NetQ2_3: Q2.3(C) R55.1
NetR56_1: R56.1 R58.2 U19.3(~{FAULT}) ; port USB_OTG_FS_OVRCR_EXTI3
NetR62_2: R62.2 U19.4(~{EN}) ; port USB_OTG_FS_PWR_EN

Not connected (* = marked no-connect by the designer): U20 A2(Dz)* B1(Pd1)* B2(Pup)* C2(Pd2)*

### Layout directives
differential pair: USB_N, USB_P

### Notes on the sheet
- VBUS OVRCR LED
- VBUS OK LED
- (near R61) 0603
- (near C66) 0603
- (near U20) ESD PROTECTION SHOULD BE CLOSE TO THE CONNECTOR
- Designed by DiZiC
- Title:
- Project:
- Size:
- Date:
- A4
- Reference:
- Sheet:
- Revision:
- of
- (in symbol 475900001) USB_Micro-AB receptacle

### Library data of the parts
C66 = CAP_NPOL: Capacitor_not polarized
CN9 = 475900001: USB-MICRO-AB, 47590-0001, SMT, MOLEX; Fitted: YES; Ordered_By: Subcon; Manuf_Part_1: 47590-0001; Manuf_1: MOLEX; ECCN_US/EU: n/a; Distrib: *; Value: 475900001; Order_Code: *
LD8 LD9 = LED: Light-Emitting Diode; Part Number A: *
Q2 = BSR14: as Q1 on sheet MB1297_STLINK_V2-1
R55-R59 R61 R62 = RES: Resistor
U19 = STMPS2141STR: Enhanced single channel power switches; Manuf_1: STM; ECCN_US/EU: EAR99/NEC; Ref St: 9159003; Fitted: YES; Manuf_Part_1: STMPS2141STR; Distrib: STM; Ordered_By: STM; Order_Code: STMPS2141STR; Value: STMPS2141STR
U20 = EMIF02-USB03F2: as U18 on sheet MB1297_STLINK_V2-1; Manuf_Part_1: EMIF02-USB03F2; Distrib: ST; Order_code: EMIF02-USB03F2; Ordered_By: STM; Value: EMIF02-USB03F2